# Altium project QUTMS-AMU-2021.PrjPcb (part 2 of 3)

## Sheet AMU-S12-V00-TSALControl.SchDoc: TSAL Control
size A3; DrawnBy: Tom Benedetti; SheetNumber: 11; SheetTotal: 25; Version: 00; Project: TSAL; PageSetup: Record=PageOptions|CenterHorizontal=True|CenterVertical=True|PrintScale=0.97|XCorrection=1.00|YCorrection=1.00|PrintKind=0|BorderSize=5000000|LeftOffset=0|BottomOffset=0|Orientation=2|PaperLength=1000|PaperWidth=1000|Scale=100|PaperSource=7|PrintQuality=-4|MediaType=1|DitherType=10|PaperKind=A4|PrintScaleMode=1
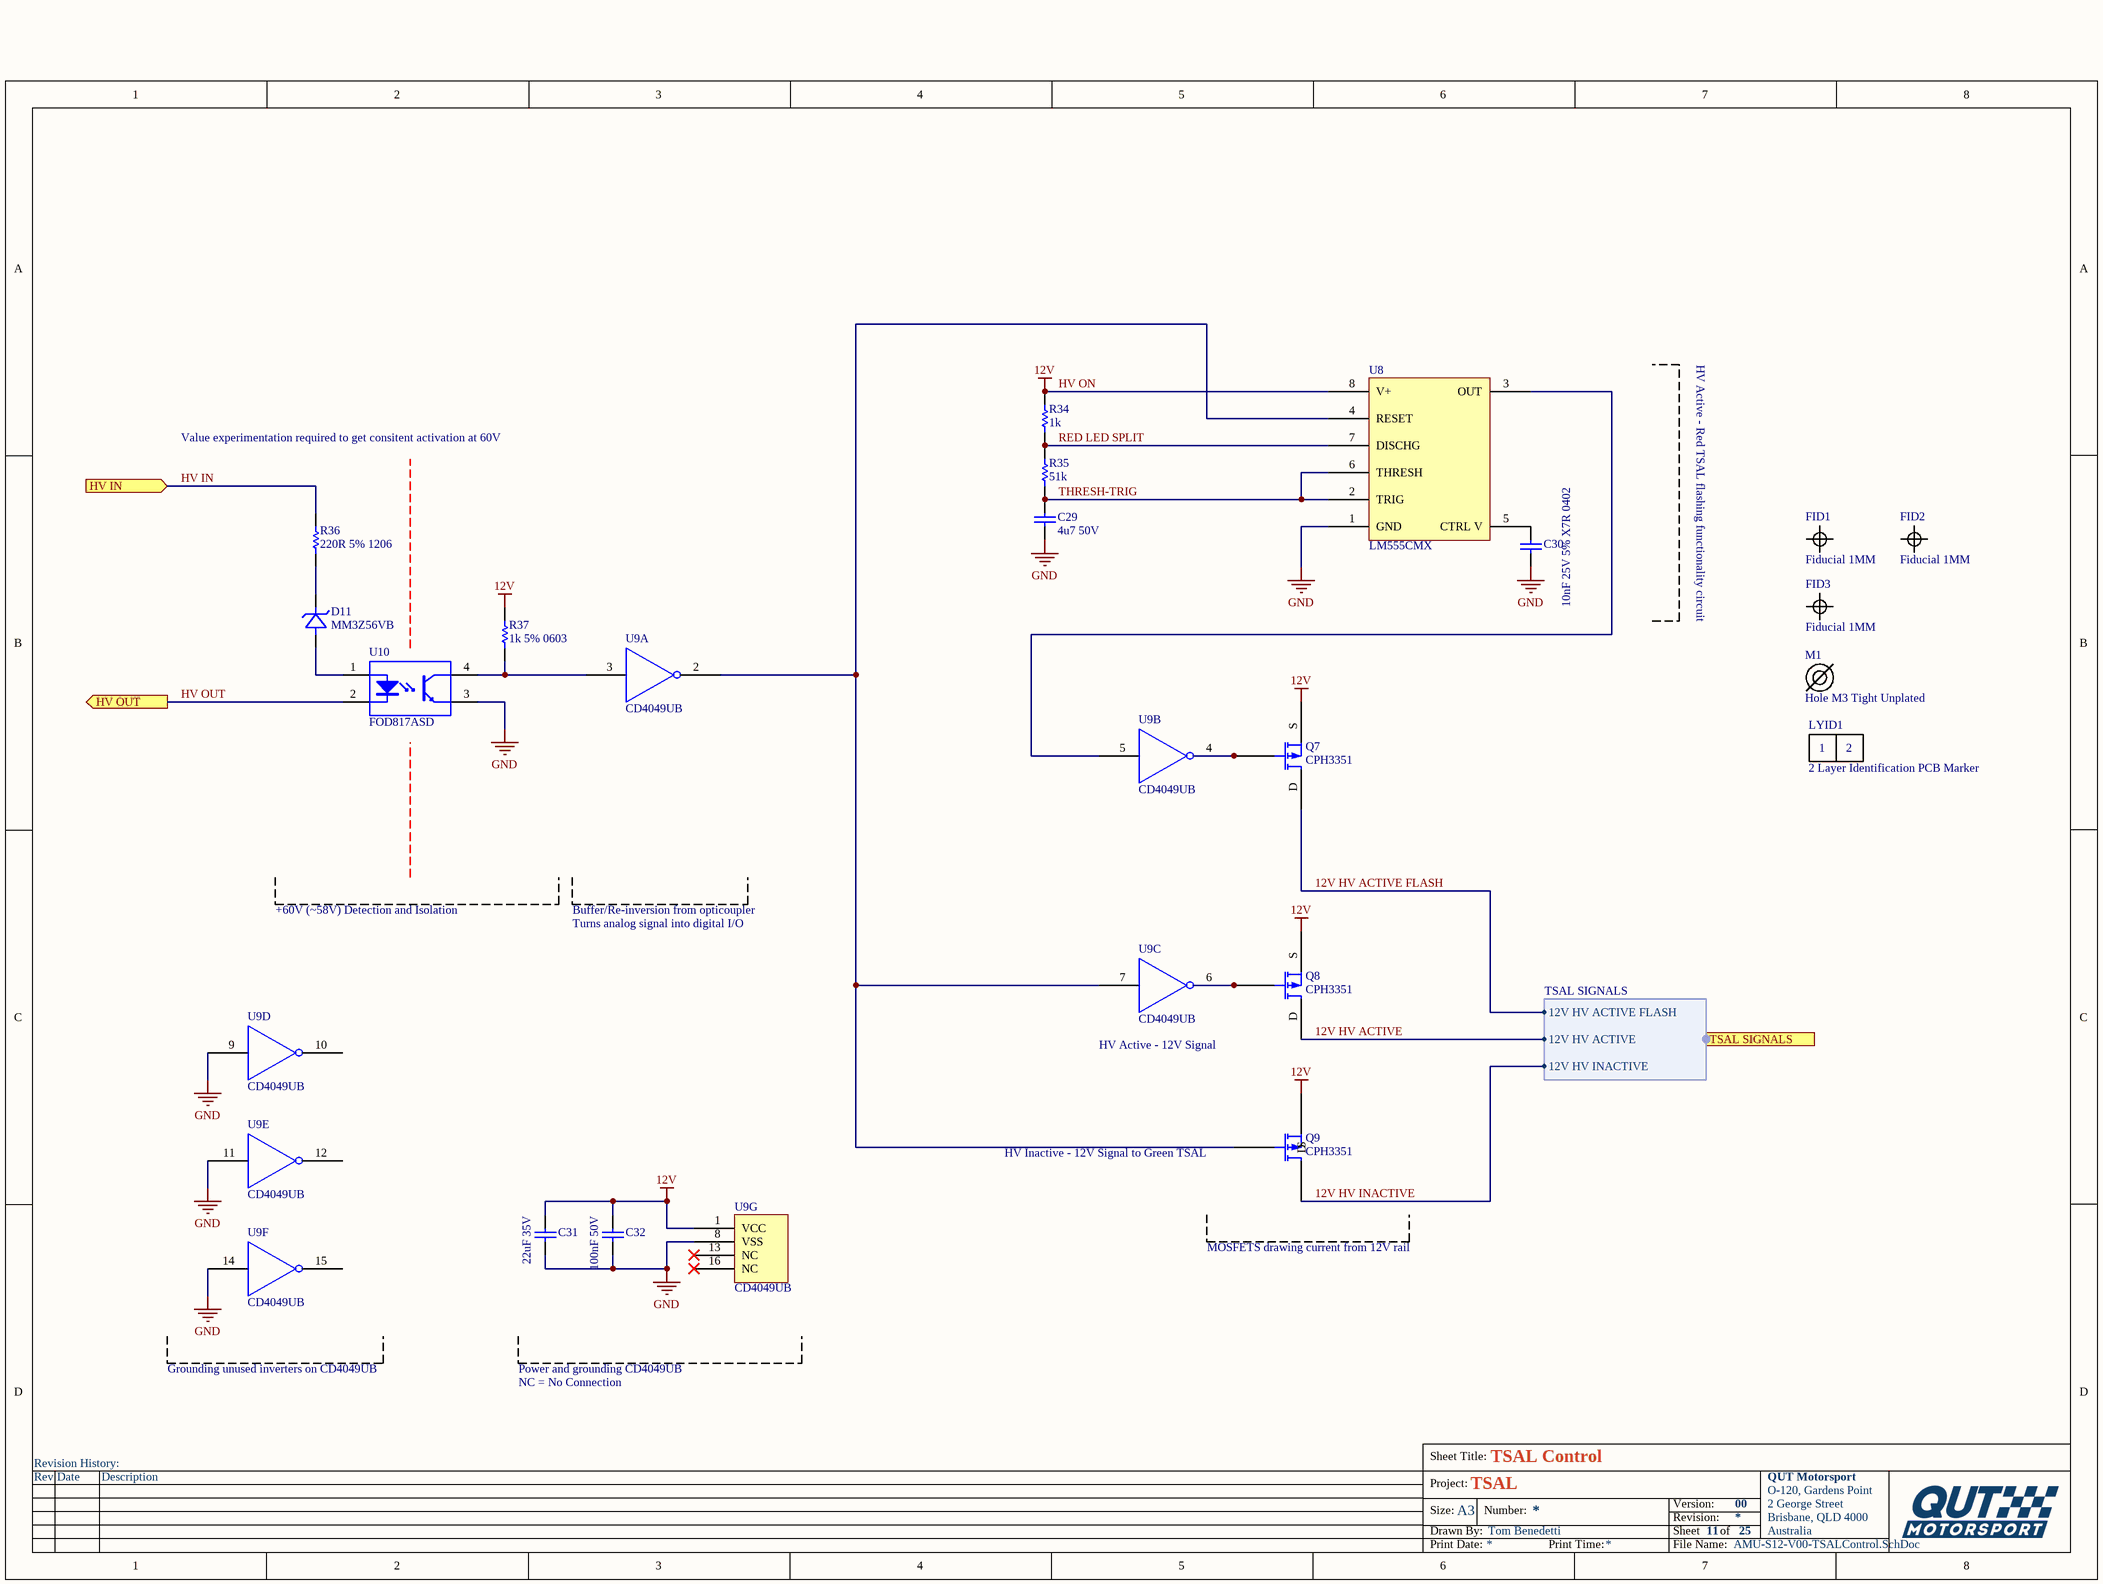
[diagram p10: AMU-S12-V00-TSALControl.SchDoc]

### Parts
(Parts that share a designator on the sheet are numbered #1, #2 ... from top to bottom, then left to right.)
C29  4u7 50V  [Cap_Ceramic_0603]
C30  10nF 25V 5% X7R 0402  [Cap_Ceramic_1206]
C31  22uF 35V  [Cap_Ceramic_1206]
C32  100nF 50V  [Cap_Ceramic_0603]
D11#1  MM3Z56VB  [SOD-323F]
FID1  Fiducial 1MM  [FIDUCIAL 1MM]
FID2  Fiducial 1MM  [FIDUCIAL 1MM]
FID3  Fiducial 1MM  [FIDUCIAL 1MM]
LYID1  2 Layer Identification PCB Marker  [LAYER IDENT 2]
M1  Hole M3 Tight Unplated  [M3.2 UNPLATED]
Q7  CPH3351  [SOT-23-3]
Q8#1  CPH3351  [SOT-23-3]
Q9#1  CPH3351  [SOT-23-3]
R34  1k  [Res_ThinFilm_0603]
R35#1  51k  [Res_ThinFilm_0603]
R36#1  220R 5% 1206  [Res_ThinFilm_1206]
R37  1k 5% 0603  [Res_ThinFilm_0603]
U8  LM555CMX  [MCP2561 SOIC]
U9  CD4049UB  [CD4049UB]  (parts A,B,C,D,E,F,G of 7)
U10  FOD817ASD  [FOD817ASD]

### Ports
HV IN (in), HV OUT (out), TSAL SIGNALS (harness TSAL SIGNALS)

### Harnesses
TSAL SIGNALS: 12V HV ACTIVE, 12V HV ACTIVE FLASH, 12V HV INACTIVE

### Nets
GND: C29.1 C30.1 C31.1 C32.1 U8.1(GND) U9.8(VSS) U9.9(D) U9.11(E) U9.14(F) U10.3(EMITTER)
HV ON: C31.2 C32.2 Q7.S Q8#1.S Q9#1.S R34.2 R37.2 U8.8(V+) U9.1(VCC)  [also labelled 12V]
12V HV ACTIVE: Q8#1.D ; port TSAL SIGNALS.12V HV ACTIVE
12V HV ACTIVE FLASH: Q7.D ; port TSAL SIGNALS.12V HV ACTIVE FLASH
12V HV INACTIVE: Q9#1.D ; port TSAL SIGNALS.12V HV INACTIVE
HV IN: R36#1.2 ; port HV IN
HV OUT: U10.2(CATHODE) ; port HV OUT
RED LED SPLIT: R34.1 R35#1.2 U8.7(DISCHG)
THRESH-TRIG: C29.2 R35#1.1 U8.2(TRIG) U8.6(THRESH)
NetC30_2: C30.2 U8.5(CTRL_V)
NetD11#1_1: D11#1.1(Anode) U10.1(ANODE)
NetD11#1_2: D11#1.2(Cathode) R36#1.1
NetQ7_G: Q7.G U9.4(H)
NetQ8#1_G: Q8#1.G U9.6(I)
NetQ9#1_G: Q9#1.G U8.4(RESET) U9.2(G) U9.7(C)
NetR37_1: R37.1 U9.3(A) U10.4(COLLECTOR)
NetU8_3: U8.3(OUT) U9.5(B)

Not connected (* = marked no-connect by the designer): U9 10(J) 12(K) 13(NC)* 15(L) 16(NC)*

### Notes on the sheet
- HV Active - Red TSAL flashing functionality circuit
- Value experimentation required to get consitent activation at 60V
- +60V (~58V) Detection and Isolation
- Buffer/Re-inversion from opticoupler
- Turns analog signal into digital I/O
- HV Active - 12V Signal
- (near Q9#1) HV Inactive - 12V Signal to Green TSAL
- MOSFETS drawing current from 12V rail
- Grounding unused inverters on CD4049UB
- Power and grounding CD4049UB
- NC = No Connection
- Revision History:
- Sheet Title:
- Rev
- Date
- Description
- Project:
- Size:
- Drawn By:
- A3
- Number:
- Revision:
- Sheet
- Version:
- of
- QUT Motorsport
- O-120, Gardens Point
- 2 George Street
- Brisbane, QLD 4000
- Australia
- Print Date:
- Print Time:
- File Name:
- (in symbol Layer Identification 2) 1; 2

### Library data of the parts
C29 = 4u7 50V 5% X7R 0603: as C15 on sheet AMU-S04-V00-Microcontroller
C30 = 10nF 25V 5% X7R 0402: 10000pF ±5% 25V Ceramic Capacitor X7R 0402 (1005 Metric) /; ComponentLink1Description: Digikey; ComponentLink1URL: https://www.digikey.com/product-detail/en/murata-electronics/GRM155R71E103JA01J/490-6340-1-ND/3845537; ComponentLink2Description: Datasheet; ComponentLink2URL: https://search.murata.co.jp/Ceramy/image/img/A01X/G101/ENG/GRM155R71E103JA01-01.pdf
C31 = 22uF 35V 20% X5R 1206: 22µF ±20% 35V Ceramic Capacitor X5R 1206 (3216 Metric); ComponentLink1Description: Digikey; ComponentLink1URL: https://www.digikey.com.au/product-detail/en/tdk-corporation/C3216X5R1V226M160AC/445-8045-1-ND/2792165; ComponentLink2Description: Datasheet; ComponentLink2URL: https://product.tdk.com/info/en/catalog/datasheets/mlcc_commercial_general_en.pdf
C32 = 100nF 50V 5% X7R 0603: as C1 on sheet AMU-S02-V00-PSU3V3
D11#1 = MM3Z56VB: Zener Diode 56V 200mW ±2% Surface Mount SOD-323F; Manufacturer: ON Semiconductor; MPN: MM3Z56VB; ComponentLink1Description: Digikey; ComponentLink1URL: https://www.digikey.com.au/product-detail/en/on-semiconductor/MM3Z56VB/MM3Z56VBCT-ND/1626897; ComponentLink2Description: Datasheet; ComponentLink2URL: https://www.onsemi.com/pub/Collateral/MM3Z9V1B-D.pdf
LYID1 = Layer Identification 2
M1 = Hole M3 Tight Unplated: M3.2 Hole, No Plating
Q7 Q8#1 Q9#1 = CPH3351: P-Channel 60V 1.8A (Ta) 1W (Ta) Surface Mount 3-CPH; ComponentLink1Description: Datasheet; ComponentLink1URL: https://www.onsemi.com/pub/Collateral/CPH3351-D.PDF; ComponentLink2Description: Digikey; ComponentLink2URL: https://www.digikey.com/products/en/discrete-semiconductor-products/transistors-fets-mosfets-single/278?k=&pkeyword=&sv=0&pv7=2&sf=0&FV=-1%7C488%2C-8%7C278&mpart=CPH3351-TL-W&quantity=&ColumnSort=0&page=1&stock=1&nstock=1&datasheet=1&photo=1&pageSize=25
R34 R37 = 1k 5% 0603: Resistor, SMD, 1k, 0.1W, 5%, 0603
R35#1 = 51k 5% 0603: 51 kOhms ±0.1% 0.063W, 1/16W Chip Resistor 0402 (1005 Metric) Automotive AEC-Q200 Thin Film; ComponentLink1Description: Digikey; ComponentLink1URL: https://www.digikey.com.au/product-detail/en/panasonic-electronic-components/ERA-2AEB513X/P51KDCCT-ND/1706224; ComponentLink2Description: Datasheet1; ComponentLink2URL: https://industrial.panasonic.com/cdbs/www-data/pdf/RDM0000/AOA0000C307.pdf; ComponentLink3Description: Datasheet2; ComponentLink3URL: https://media.digikey.com/pdf/Data%20Sheets/Panasonic%20Resistors%20Thermistors%20PDFs/ERA_Series_LE.pdf; ComponentLink4Description: Datasheet3; ComponentLink4URL: https://industrial.panasonic.com/cdbs/www-data/pdf/RDM0000/DMM0000COL9.pdf
R36#1 = 220R 5% 1206: 220 Ohms ±1% 0.25W, 1/4W Chip Resistor 1206 (3216 Metric) Moisture Resistant Thick Film; ComponentLink1Description: Digikey; ComponentLink1URL: https://www.digikey.com.au/product-detail/en/yageo/RC1206FR-07220RL/311-220FRCT-ND/731640; ComponentLink2Description: Datasheet; ComponentLink2URL: https://www.yageo.com/upload/media/product/productsearch/datasheet/rchip/PYu-RC_Group_51_RoHS_L_10.pdf
U8 = LM555CMX: 555 Type, Timer/Oscillator (Single) IC 100kHz 8-SOIC; ComponentLink1Description: Digikey; ComponentLink1URL: https://www.digikey.com.au/product-detail/en/texas-instruments/LM555CMX%2FNOPB/LM555CMX%2FNOPBCT-ND/1010545?utm_adgroup=Integrated%20Circuits&utm_source=google&utm_medium=cpc&utm_campaign=Dynamic%20Search_EN_Product&utm_term=&productid=&gclid=CjwKCAjwr7X4BRA4EiwAUXjbt-N3vibcCncJp7dB6lpBrLRT-QxYTJoHZmGPqFSswFIeP9Lhu7cYVBoCjmMQAvD_BwE; ComponentLink2Description: Datasheet; ComponentLink2URL: https://www.ti.com/general/docs/suppproductinfo.tsp?distId=10&gotoUrl=http%3A%2F%2Fwww.ti.com%2Flit%2Fgpn%2Flm555
U10 = FOD817ASD: Optoisolator 5kV Transistor 4SMD

## Sheet AMU-S27-V00-MX120G-Interface.SchDoc
size A3; SheetNumber: 23; SheetTotal: 25
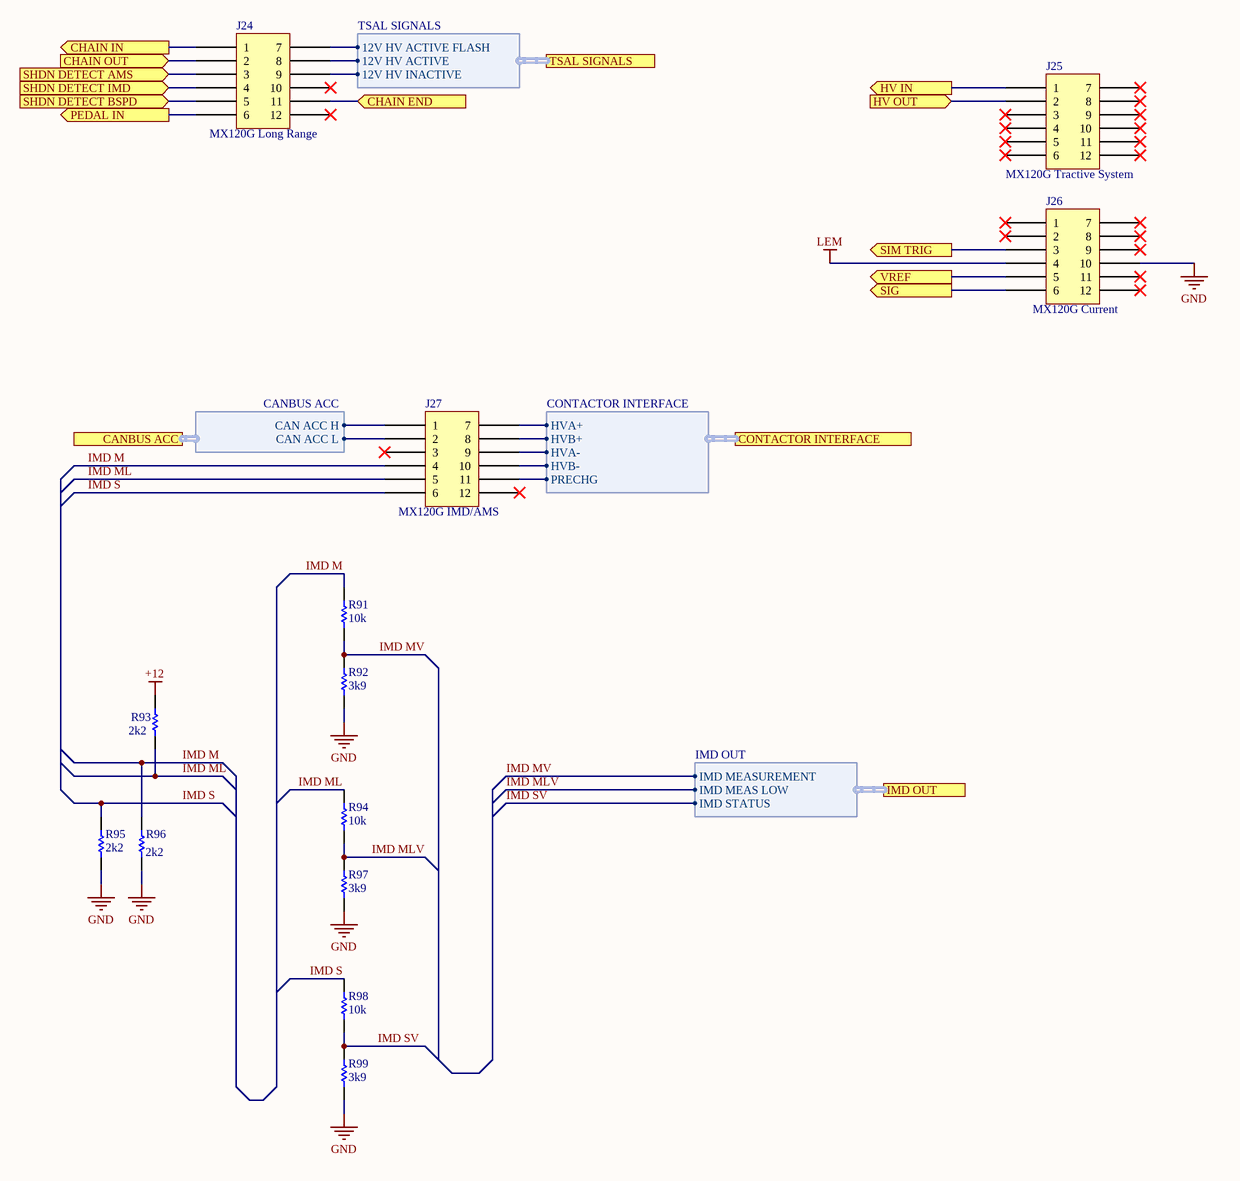
[diagram p11: AMU-S27-V00-MX120G-Interface.SchDoc]

### Parts
J24  MX120G Long Range  [MX120G]
J25  MX120G Tractive System  [MX120G]
J26  MX120G Current  [MX120G]
J27  MX120G IMD/AMS  [MX120G]
R91  10k  [Res_ThinFilm_0603]
R92  3k9  [Res_ThinFilm_0603]
R93  2k2  [Res_ThinFilm_0603]
R94  10k  [Res_ThinFilm_0603]
R95  2k2  [Res_ThinFilm_0603]
R96  2k2  [Res_ThinFilm_0603]
R97  3k9  [Res_ThinFilm_0603]
R98  10k  [Res_ThinFilm_0603]
R99  3k9  [Res_ThinFilm_0603]

### Ports
CANBUS ACC (harness CANBUS ACC), CHAIN END (in), CHAIN IN (out), CHAIN OUT (in), CONTACTOR INTERFACE (harness CONTACTOR INTERFACE), HV IN (out), HV OUT (in), IMD OUT (harness IMD OUT), PEDAL IN (out), SHDN DETECT AMS (in), SHDN DETECT BSPD (in), SHDN DETECT IMD (in), SIG (out), SIM TRIG (out), TSAL SIGNALS (harness TSAL SIGNALS), VREF (out)

### Harnesses
CONTACTOR INTERFACE: HVA-, HVB+, HVA+, HVB-, PRECHG
IMD OUT: IMD MEASUREMENT, IMD MEAS LOW, IMD STATUS
TSAL SIGNALS: 12V HV INACTIVE, 12V HV ACTIVE, 12V HV ACTIVE FLASH
CANBUS ACC: CAN ACC H, CAN ACC L

### Nets
+12: R93.2
GND: J26.10 R92.1 R95.1 R96.1 R97.1 R99.1
LEM: J26.4
12V HV ACTIVE: J24.8 ; port TSAL SIGNALS.12V HV ACTIVE
12V HV ACTIVE FLASH: J24.7 ; port TSAL SIGNALS.12V HV ACTIVE FLASH
12V HV INACTIVE: J24.9 ; port TSAL SIGNALS.12V HV INACTIVE
CAN ACC H: J27.1 ; port CANBUS ACC.CAN ACC H
CAN ACC L: J27.2 ; port CANBUS ACC.CAN ACC L
CHAIN END: J24.11 ; port CHAIN END
CHAIN IN: J24.1 ; port CHAIN IN
CHAIN OUT: J24.2 ; port CHAIN OUT
CONTACTOR INTERFACE.HVA+: J27.7 ; port CONTACTOR INTERFACE.HVA+
CONTACTOR INTERFACE.HVA-: J27.9 ; port CONTACTOR INTERFACE.HVA-
CONTACTOR INTERFACE.HVB+: J27.8 ; port CONTACTOR INTERFACE.HVB+
CONTACTOR INTERFACE.HVB-: J27.10 ; port CONTACTOR INTERFACE.HVB-
CONTACTOR INTERFACE.PRECHG: J27.11 ; port CONTACTOR INTERFACE.PRECHG
HV IN: J25.1 ; port HV IN
HV OUT: J25.2 ; port HV OUT
IMD M: J27.4 R91.2 R96.2
IMD ML: J27.5 R93.1 R94.2
IMD MLV: R94.1 R97.2 ; port IMD OUT.IMD MEAS LOW
IMD MV: R91.1 R92.2 ; port IMD OUT.IMD MEASUREMENT
IMD S: J27.6 R95.2 R98.2
IMD SV: R98.1 R99.2 ; port IMD OUT.IMD STATUS  [project net IMD OUT.IMD STATUS]
LEM REF: J26.5 ; port VREF
LEM SIG: J26.6 ; port SIG
PEDAL IN: J24.6 ; port PEDAL IN
SHDN DETECT AMS: J24.3 ; port SHDN DETECT AMS
SHDN DETECT BSPD: J24.5 ; port SHDN DETECT BSPD
SHDN DETECT IMD: J24.4 ; port SHDN DETECT IMD
SIM TRIG: J26.3 ; port SIM TRIG

Not connected (* = marked no-connect by the designer): J24 10* 12*; J25 3* 4* 5* 6* 7* 8* 9* 10* 11* 12*; J26 1* 2* 7* 8* 9* 11* 12*; J27 3* 12*

### Library data of the parts
J24-J27 = MX120G: MX120G with standard connector layout
R91 R94 R98 = 10k 1% 0603: Resistor, SMD, 10k, 0.1W, 1%, 0603
R92 R97 R99 = 3k9 5% 0603: Resistor, SMD, 3k9, 0.1W, 5%, 0603
R93 R95 R96 = 2k2 5% 0603: Resistor, SMD, 2k2, 0.1W, 5%, 0603

## Sheet AMU-S13-V00-BSPDShutdownRelay.SchDoc: Shutdown Relay
size A3; DrawnBy: Jonn Dillon; DocumentNumber: 9; Revision: 01; SheetNumber: 13; SheetTotal: 31
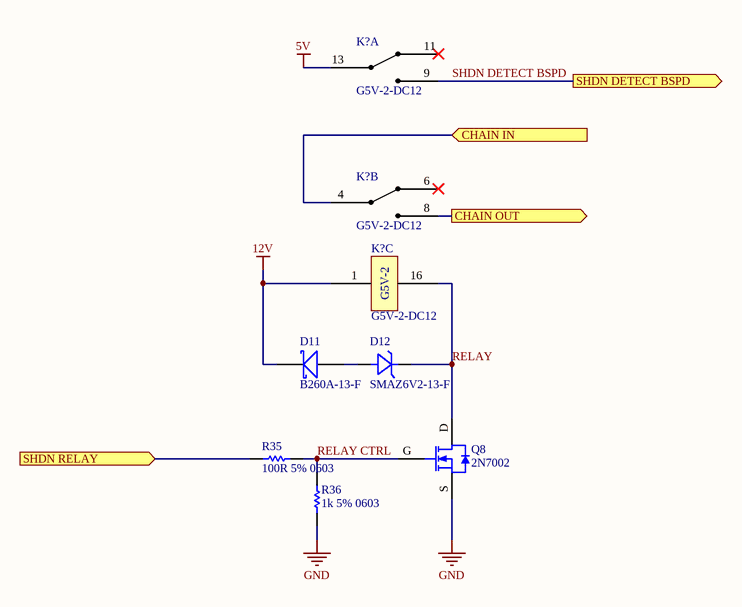
[diagram p12: AMU-S13-V00-BSPDShutdownRelay.SchDoc]

### Parts
(Parts that share a designator on the sheet are numbered #1, #2 ... from top to bottom, then left to right.)
D11#2  B260A-13-F  [SMA]
D12  SMAZ6V2-13-F  [SMA]
K?#1  G5V-2-DC12  [G5V-2]  (part A of 3)
K?#2  G5V-2-DC12  [G5V-2]  (part B of 3)
K?#3  G5V-2-DC12  [G5V-2]  (part C of 3)
Q8#2  2N7002  [SOT23-3]
R35#2  100R 5% 0603  [Res_ThinFilm_0603]
R36#2  1k 5% 0603  [Res_ThinFilm_0603]

### Ports
CHAIN IN (in), CHAIN OUT (out), SHDN DETECT BSPD (out), SHDN RELAY (in)

### Nets
5V: K?#1.13
12V: D11#2.K K?#3.1  [project net HV ON]
GND: Q8#2.S R36#2.1
BSPD6: R35#2.1 ; port SHDN RELAY
CHAIN BSPD-AMS: K?#2.8 ; port CHAIN OUT
CHAIN IN: K?#2.4 ; port CHAIN IN
RELAY: D12.K(Cathode) K?#3.16 Q8#2.D
RELAY CTRL: Q8#2.G R35#2.2 R36#2.2
SHDN DETECT BSPD: K?#1.9 ; port SHDN DETECT BSPD
NetD11#2_A: D11#2.A D12.A(Anode)

Not connected (* = marked no-connect by the designer): K?#1 11*; K?#2 6*

### Notes on the sheet
- Revision History:
- Sheet Title:
- Rev
- Date
- Description
- Project:
- Size:
- Drawn By:
- A3
- Number:
- Revision:
- Sheet
- Version:
- of
- QUT Motorsport
- O-120, Gardens Point
- 2 George Street
- Brisbane, QLD 4000
- Australia
- Print Date:
- Print Time:
- File Name:
- (in symbol G5V-2-DC12, part C) G5V-2

### Library data of the parts
D11#2 = B260A-13-F: Diode, Schottky Barrier Rectifier, 60 V, 2 A, B260A-13-F
D12 = SMAZ6V2-13-F: Zener Diode 6.2V 1W ±5% Surface Mount SMA; Manufacturer: Generic; MPN: 5V6 500mW SMA
K?#1-K?#3 = G5V-2-DC12: General Purpose Relay DPDT (2 Form C) Through Hole, 12V, 2A
R35#2 = 100R 5%, 0603: Resistor, SMD, 100R, 0.1W, 5%, 0603
R36#2 = 1k 5% 0603: Resistor, SMD, 1k, 0.1W, 5%, 0603

## Sheet AMU-S15-V00-BSPDSystem.SchDoc: BSPD System
size A3; DrawnBy: Jonn Dillon; DocumentNumber: 2; Revision: 01; SheetNumber: 13; SheetTotal: 23
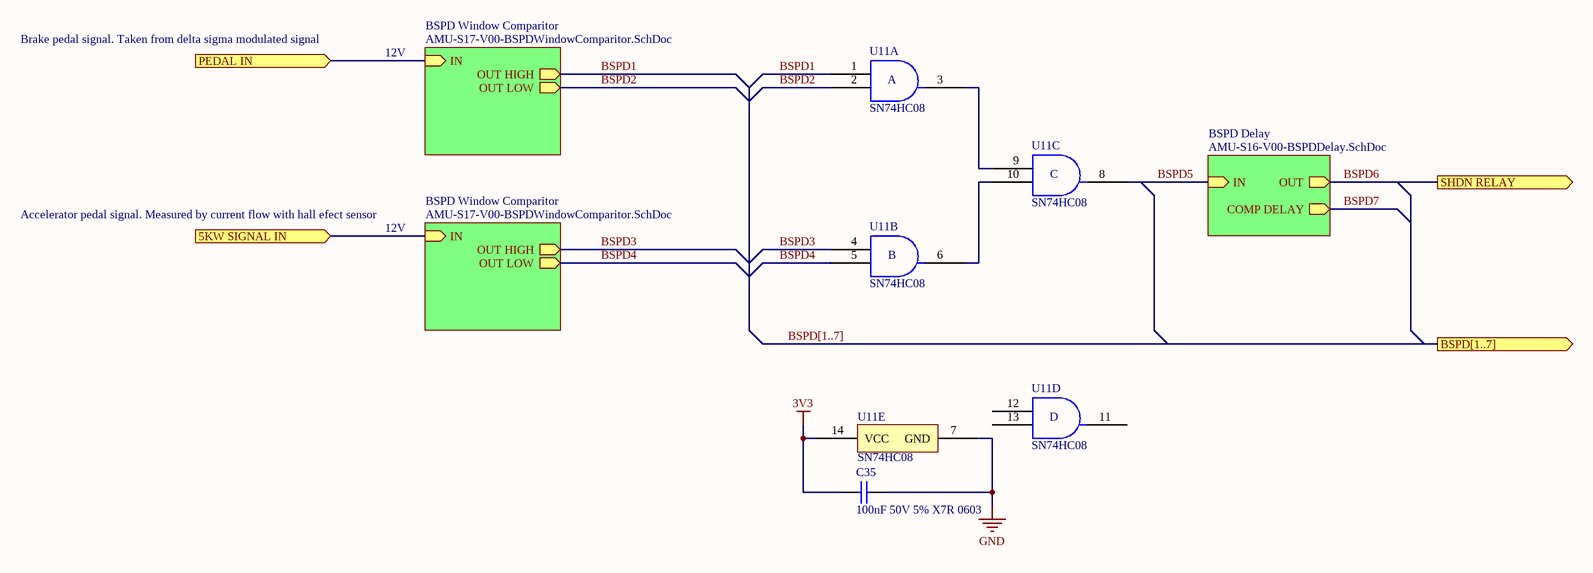
[diagram p13: AMU-S15-V00-BSPDSystem.SchDoc]

### Parts
(Parts that share a designator on the sheet are numbered #1, #2 ... from top to bottom, then left to right.)
C35#1  100nF 50V 5% X7R 0603  [Cap_Ceramic_0603]
U11  SN74HC08  [TSSOP-14]  (parts A,B,C,D,E of 5)

### Sub-sheets
BSPD Delay = AMU-S16-V00-BSPDDelay.SchDoc: OUT (out), IN (in), COMP DELAY (out)
BSPD Window Comparitor = AMU-S17-V00-BSPDWindowComparitor.SchDoc: OUT HIGH (out), IN (in), OUT LOW (out)
BSPD Window Comparitor = AMU-S17-V00-BSPDWindowComparitor.SchDoc: OUT HIGH (out), IN (in), OUT LOW (out)

### Ports
5KW SIGNAL IN (in), BSPD[1..7] (out), PEDAL IN (in), SHDN RELAY (out)

### Nets
3V3: C35#1.2 U11.14(VCC)
GND: C35#1.1 U11.7(GND)
5kW ALARM: port 5KW SIGNAL IN, sheet BSPD Window Comparitor/IN
BSPD1: U11.1(1A) ; sheet BSPD Window Comparitor/OUT HIGH
BSPD2: U11.2(1B) ; sheet BSPD Window Comparitor/OUT LOW
BSPD3: U11.4(2A) ; sheet BSPD Window Comparitor/OUT HIGH
BSPD4: U11.5(2B) ; sheet BSPD Window Comparitor/OUT LOW
BSPD5: U11.8(3Y) ; sheet BSPD Delay/IN
BSPD6: port SHDN RELAY, sheet BSPD Delay/OUT
PEDAL IN: port PEDAL IN, sheet BSPD Window Comparitor/IN
NetU11_3: U11.3(1Y) U11.9(3A)
NetU11_6: U11.6(2Y) U11.10(3B)

Not connected (* = marked no-connect by the designer): U11 11(4Y) 12(4A) 13(4B)

### Buses and harness runs
bus BSPD[1..7] = port BSPD[1..7]

### Notes on the sheet
- Brake pedal signal. Taken from delta sigma modulated signal
- 12V
- Accelerator pedal signal. Measured by current flow with hall efect sensor
- Revision History:
- Sheet Title:
- Rev
- Date
- Description
- Project:
- Size:
- Drawn By:
- A3
- Number:
- Revision:
- Sheet
- Version:
- of
- QUT Motorsport
- O-120, Gardens Point
- 2 George Street
- Brisbane, QLD 4000
- Australia
- Print Date:
- Print Time:
- File Name:
- (in symbol SN74HC08, part A) A
- (in symbol SN74HC08, part B) B
- (in symbol SN74HC08, part C) C
- (in symbol SN74HC08, part D) D

### Library data of the parts
C35#1 = 100nF 50V 5% X7R 0603: as C1 on sheet AMU-S02-V00-PSU3V3
U11 = SN74HC08: Quadruple 2-Input Positive-AND Gates

## Sheet AMU-S16-V00-BSPDDelay.SchDoc: RC Charging Delay
size A3; DrawnBy: Jonn Dillon; DocumentNumber: 4; Revision: 01; SheetNumber: 14; SheetTotal: 25
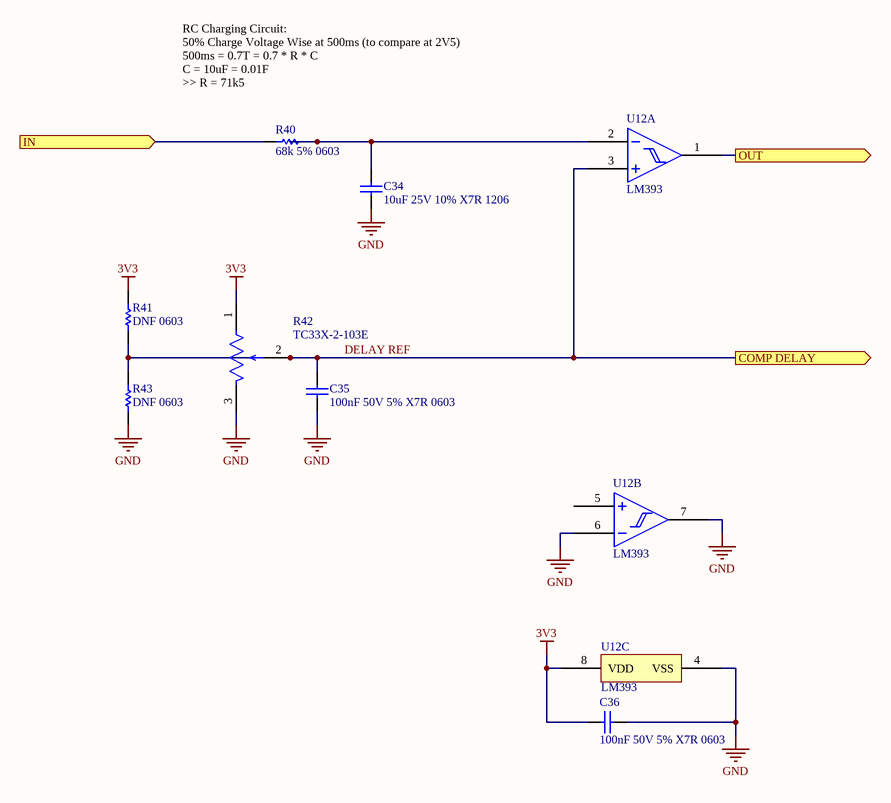
[diagram p14: AMU-S16-V00-BSPDDelay.SchDoc]

### Parts
(Parts that share a designator on the sheet are numbered #1, #2 ... from top to bottom, then left to right.)
C34  10uF 25V 10% X7R 1206  [Cap_Ceramic_1206]
C35#2  100nF 50V 5% X7R 0603  [Cap_Ceramic_0603]
C36  100nF 50V 5% X7R 0603  [Cap_Ceramic_0603]
R40  68k 5% 0603  [Res_ThinFilm_0603]
R41  DNF 0603  [Res_ThinFilm_0603]
R42  TC33X-2-103E  [TC33]
R43  DNF 0603  [Res_ThinFilm_0603]
U12  LM393  [TSSOP-8]  (parts A,B,C of 3)

### Ports
COMP DELAY (out), IN (in), OUT (out)

### Nets
3V3: C36.2 R41.2 R42.1 U12.8(VDD)
GND: C34.1 C35#2.1 C36.1 R42.3 R43.1 U12.4(VSS) U12.6(IN2-) U12.7(OUT1)
BSPD5: R40.1 ; port IN
BSPD6: U12.1(OUT1) ; port OUT
DELAY REF: C35#2.2 R41.1 R42.2 R43.2 U12.3(IN1+) ; port COMP DELAY  [project net BSPD7]
NetC34_2: C34.2 R40.2 U12.2(IN1-)

Not connected (* = marked no-connect by the designer): U12 5(IN2+)

### Notes on the sheet
- RC Charging Circuit:
  50% Charge Voltage Wise at 500ms (to compare at 2V5)
  500ms = 0.7T = 0.7 * R * C
  C = 10uF = 0.01F
  >> R = 71k5
- Revision History:
- Sheet Title:
- Rev
- Date
- Description
- Project:
- Size:
- Drawn By:
- A3
- Number:
- Revision:
- Sheet
- Version:
- of
- QUT Motorsport
- O-120, Gardens Point
- 2 George Street
- Brisbane, QLD 4000
- Australia
- Print Date:
- Print Time:
- File Name:

### Library data of the parts
C34 = 10uF 25V 10% X7R 1206: Capacitor, Ceramic, SMD, 10uF, 25V, 10%, X7R, 1206
C35#2 C36 = 100nF 50V 5% X7R 0603: as C1 on sheet AMU-S02-V00-PSU3V3
R40 = 68k 5% 0603: Resistor, SMD, 68k, 0.1W, 5%, 0603
R41 R43 = DNF 0603: Resistor, SMD, DNF, 0.1W, 0603
R42 = TC33X-2-103E: 10 kOhms 0.1W, 1/10W J Lead Surface Mount Trimmer Potentiometer Cermet 1 Turn Top Adjustment
U12 = LM393: General Purpose Comparitor 2 Circuit 8-SOIC

## Sheet AMU-S17-V00-BSPDWindowComparitor.SchDoc: Window Comparitor
size A3; DrawnBy: Jonn Dillon; DocumentNumber: 3; Revision: 01; SheetNumber: 15; SheetTotal: 25
Used 2 times, as channels BSPD System/BSPD Window Comparitor, BSPD System/BSPD Window Comparitor. Parts and nets are listed once, with the designators drawn on the sheet.
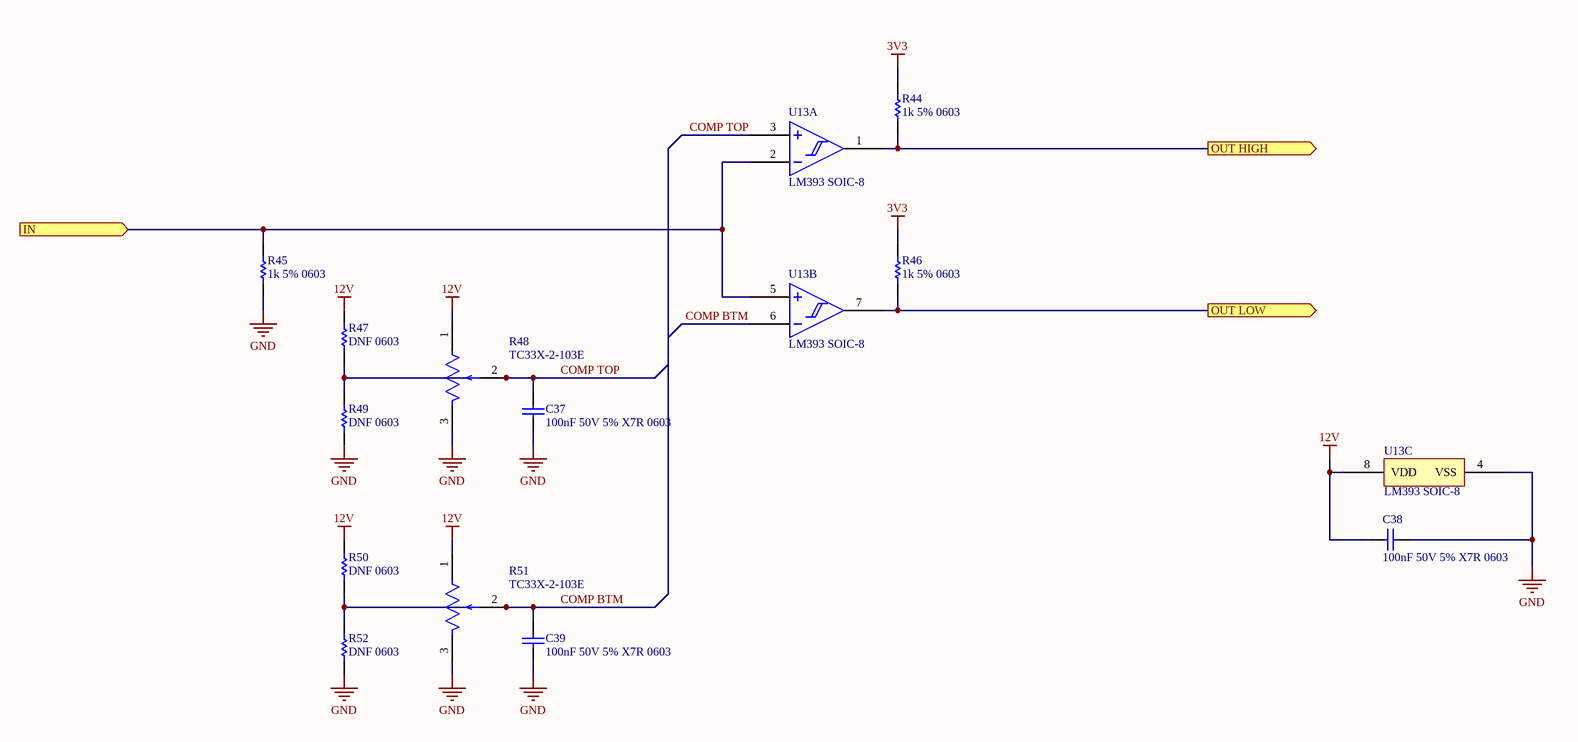
[diagram p15: AMU-S17-V00-BSPDWindowComparitor.SchDoc]

### Parts
C37  100nF 50V 5% X7R 0603  [Cap_Ceramic_0603]
C38  100nF 50V 5% X7R 0603  [Cap_Ceramic_0603]
C39  100nF 50V 5% X7R 0603  [Cap_Ceramic_0603]
R44  1k 5% 0603  [Res_ThinFilm_0603]
R45  1k 5% 0603  [Res_ThinFilm_0603]
R46  1k 5% 0603  [Res_ThinFilm_0603]
R47  DNF 0603  [Res_ThinFilm_0603]
R48  TC33X-2-103E  [TC33]
R49  DNF 0603  [Res_ThinFilm_0603]
R50  DNF 0603  [Res_ThinFilm_0603]
R51  TC33X-2-103E  [TC33]
R52  DNF 0603  [Res_ThinFilm_0603]
U13  LM393 SOIC-8  [SOIC-8]  (parts A,B,C of 3)

### Ports
IN (in), OUT HIGH (out), OUT LOW (out)

### Nets
3V3: R44.2 R46.2
12V: C38.1 R47.2 R48.1 R50.2 R51.1 U13.8(VDD)
GND: C37.1 C38.2 C39.1 R45.1 R48.3 R49.1 R51.3 R52.1 U13.4(VSS)
COMP BTM: C39.2 R50.1 R51.2 R52.2 U13.6(IN2-)
COMP TOP: C37.2 R47.1 R48.2 R49.2 U13.3(IN1+)
IN: R45.2 U13.2(IN1-) U13.5(IN2+) ; port IN
OUT HIGH: R44.1 U13.1(OUT1) ; port OUT HIGH
OUT LOW: R46.1 U13.7(OUT1) ; port OUT LOW

### Channels
BSPD System/BSPD Window Comparitor: designators end in _BSPD_System_BSPD_Window_Comparitor#1; ports IN=PEDAL IN OUT HIGH=BSPD1 OUT LOW=BSPD2
BSPD System/BSPD Window Comparitor: designators end in _BSPD_System_BSPD_Window_Comparitor#2; ports IN=5kW ALARM OUT HIGH=BSPD3 OUT LOW=BSPD4

### Notes on the sheet
- Revision History:
- Sheet Title:
- Rev
- Date
- Description
- Project:
- Size:
- Drawn By:
- A3
- Number:
- Revision:
- Sheet
- Version:
- of
- QUT Motorsport
- O-120, Gardens Point
- 2 George Street
- Brisbane, QLD 4000
- Australia
- Print Date:
- Print Time:
- File Name:

### Library data of the parts
C37-C39 = 100nF 50V 5% X7R 0603: as C1 on sheet AMU-S02-V00-PSU3V3
R44-R46 = 1k 5% 0603: Resistor, SMD, 1k, 0.1W, 5%, 0603
R47 R49 R50 R52 = DNF 0603: Resistor, SMD, DNF, 0.1W, 0603
R48 R51 = TC33X-2-103E: as R42 on sheet AMU-S16-V00-BSPDDelay
U13 = LM393: as U12 on sheet AMU-S16-V00-BSPDDelay

## Sheet AMU-S18-V00-CURRENTCurrentInterface.SchDoc: Current Sensor Circuity
size A3; DrawnBy: Jonn Dillon; DocumentNumber: 4; SheetNumber: 16; SheetTotal: 23; Project: Shutdown Current Board 2020
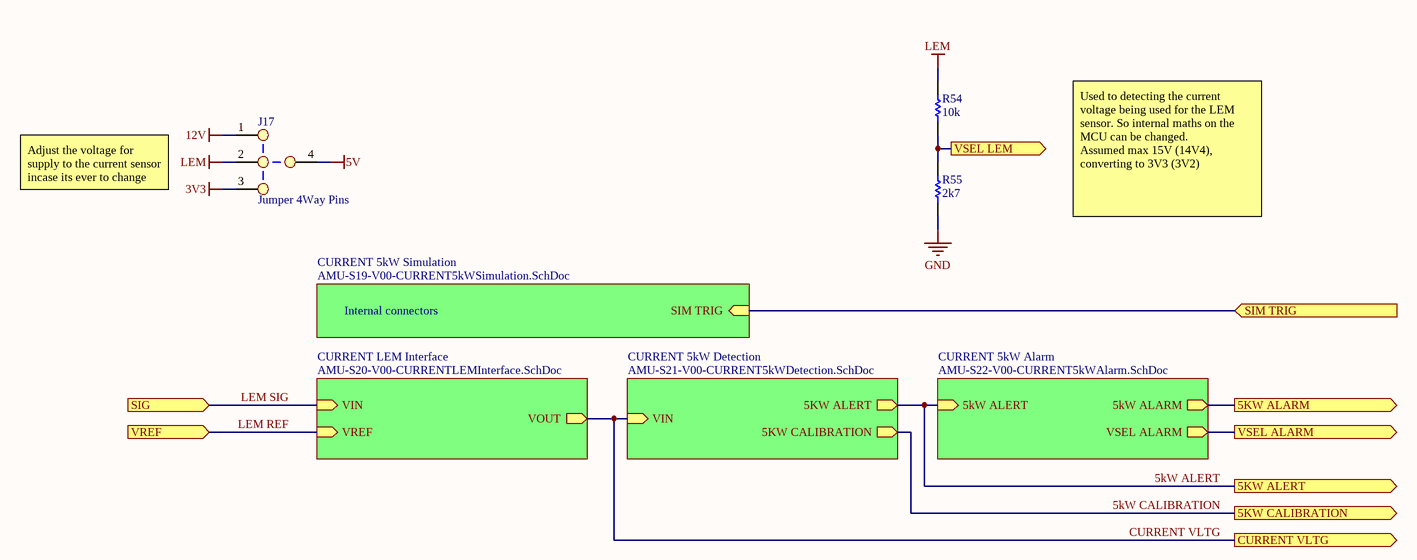
[diagram p16: AMU-S18-V00-CURRENTCurrentInterface.SchDoc]

### Parts
(Parts that share a designator on the sheet are numbered #1, #2 ... from top to bottom, then left to right.)
J17#1  Jumper 4Way Pins  [Jumper_4Way_Pin]
R54  10k  [Res_ThinFilm_0603]
R55  2k7  [Res_ThinFilm_0603]

### Sub-sheets
CURRENT 5kW Alarm = AMU-S22-V00-CURRENT5kWAlarm.SchDoc: 5kW ALARM (out), 5kW ALERT (in), VSEL ALARM (out)
CURRENT 5kW Detection = AMU-S21-V00-CURRENT5kWDetection.SchDoc: VIN (in), 5KW ALERT (out), 5KW CALIBRATION (out)
CURRENT 5kW Simulation = AMU-S19-V00-CURRENT5kWSimulation.SchDoc: SIM TRIG (in)
CURRENT LEM Interface = AMU-S20-V00-CURRENTLEMInterface.SchDoc: VOUT (out), VREF (in), VIN (in)

### Ports
5KW ALARM (out), 5KW ALERT (out), 5KW CALIBRATION (out), CURRENT VLTG (out), SIG (in), SIM TRIG (in), VREF (in), VSEL ALARM (out), VSEL LEM (out)

### Nets
3V3: J17#1.3
5V: J17#1.4
12V: J17#1.1  [project net HV ON]
GND: R55.1
LEM: J17#1.2 R54.2
5kW ALARM: port 5KW ALARM, sheet CURRENT 5kW Alarm/5kW ALARM
5kW ALERT: port 5KW ALERT, sheet CURRENT 5kW Detection/5KW ALERT, sheet CURRENT 5kW Alarm/5kW ALERT
5kW CALIBRATION: port 5KW CALIBRATION, sheet CURRENT 5kW Detection/5KW CALIBRATION
CURRENT VLTG: port CURRENT VLTG, sheet CURRENT LEM Interface/VOUT, sheet CURRENT 5kW Detection/VIN
LEM REF: port VREF, sheet CURRENT LEM Interface/VREF
LEM SIG: port SIG, sheet CURRENT LEM Interface/VIN
SIM TRIG: port SIM TRIG, sheet CURRENT 5kW Simulation/SIM TRIG
NetR54_1: R54.1 R55.2 ; port VSEL LEM
NetR67_1: port VSEL ALARM, sheet CURRENT 5kW Alarm/VSEL ALARM

### Notes on the sheet
- Adjust the voltage for supply to the current sensor incase its ever to change
- Used to detecting the current voltage being used for the LEM sensor. So internal maths on the MCU can be changed.
  Assumed max 15V (14V4), converting to 3V3 (3V2)
- Internal connectors
- Revision History:
- Sheet Title:
- Rev
- Date
- Description
- Project:
- Size:
- Drawn By:
- A3
- Number:
- Revision:
- Sheet
- Version:
- of
- QUT Motorsport
- O-120, Gardens Point
- 2 George Street
- Brisbane, QLD 4000
- Australia
- Print Date:
- Print Time:
- File Name:

### Library data of the parts
R54 = 10k 5% 0603: Resistor, SMD, 10k, 0.1W, 5%, 0603
R55 = 2k7 5% 0603: Resistor, SMD, 2k7, 0.1W, 5%, 0603

## Sheet AMU-S19-V00-CURRENT5kWSimulation.SchDoc: 5kW Simulation
size A3; DrawnBy: Jonn Dillon; DocumentNumber: 5; SheetNumber: 19; SheetTotal: 29; Project: Shutdown Current Board 2020
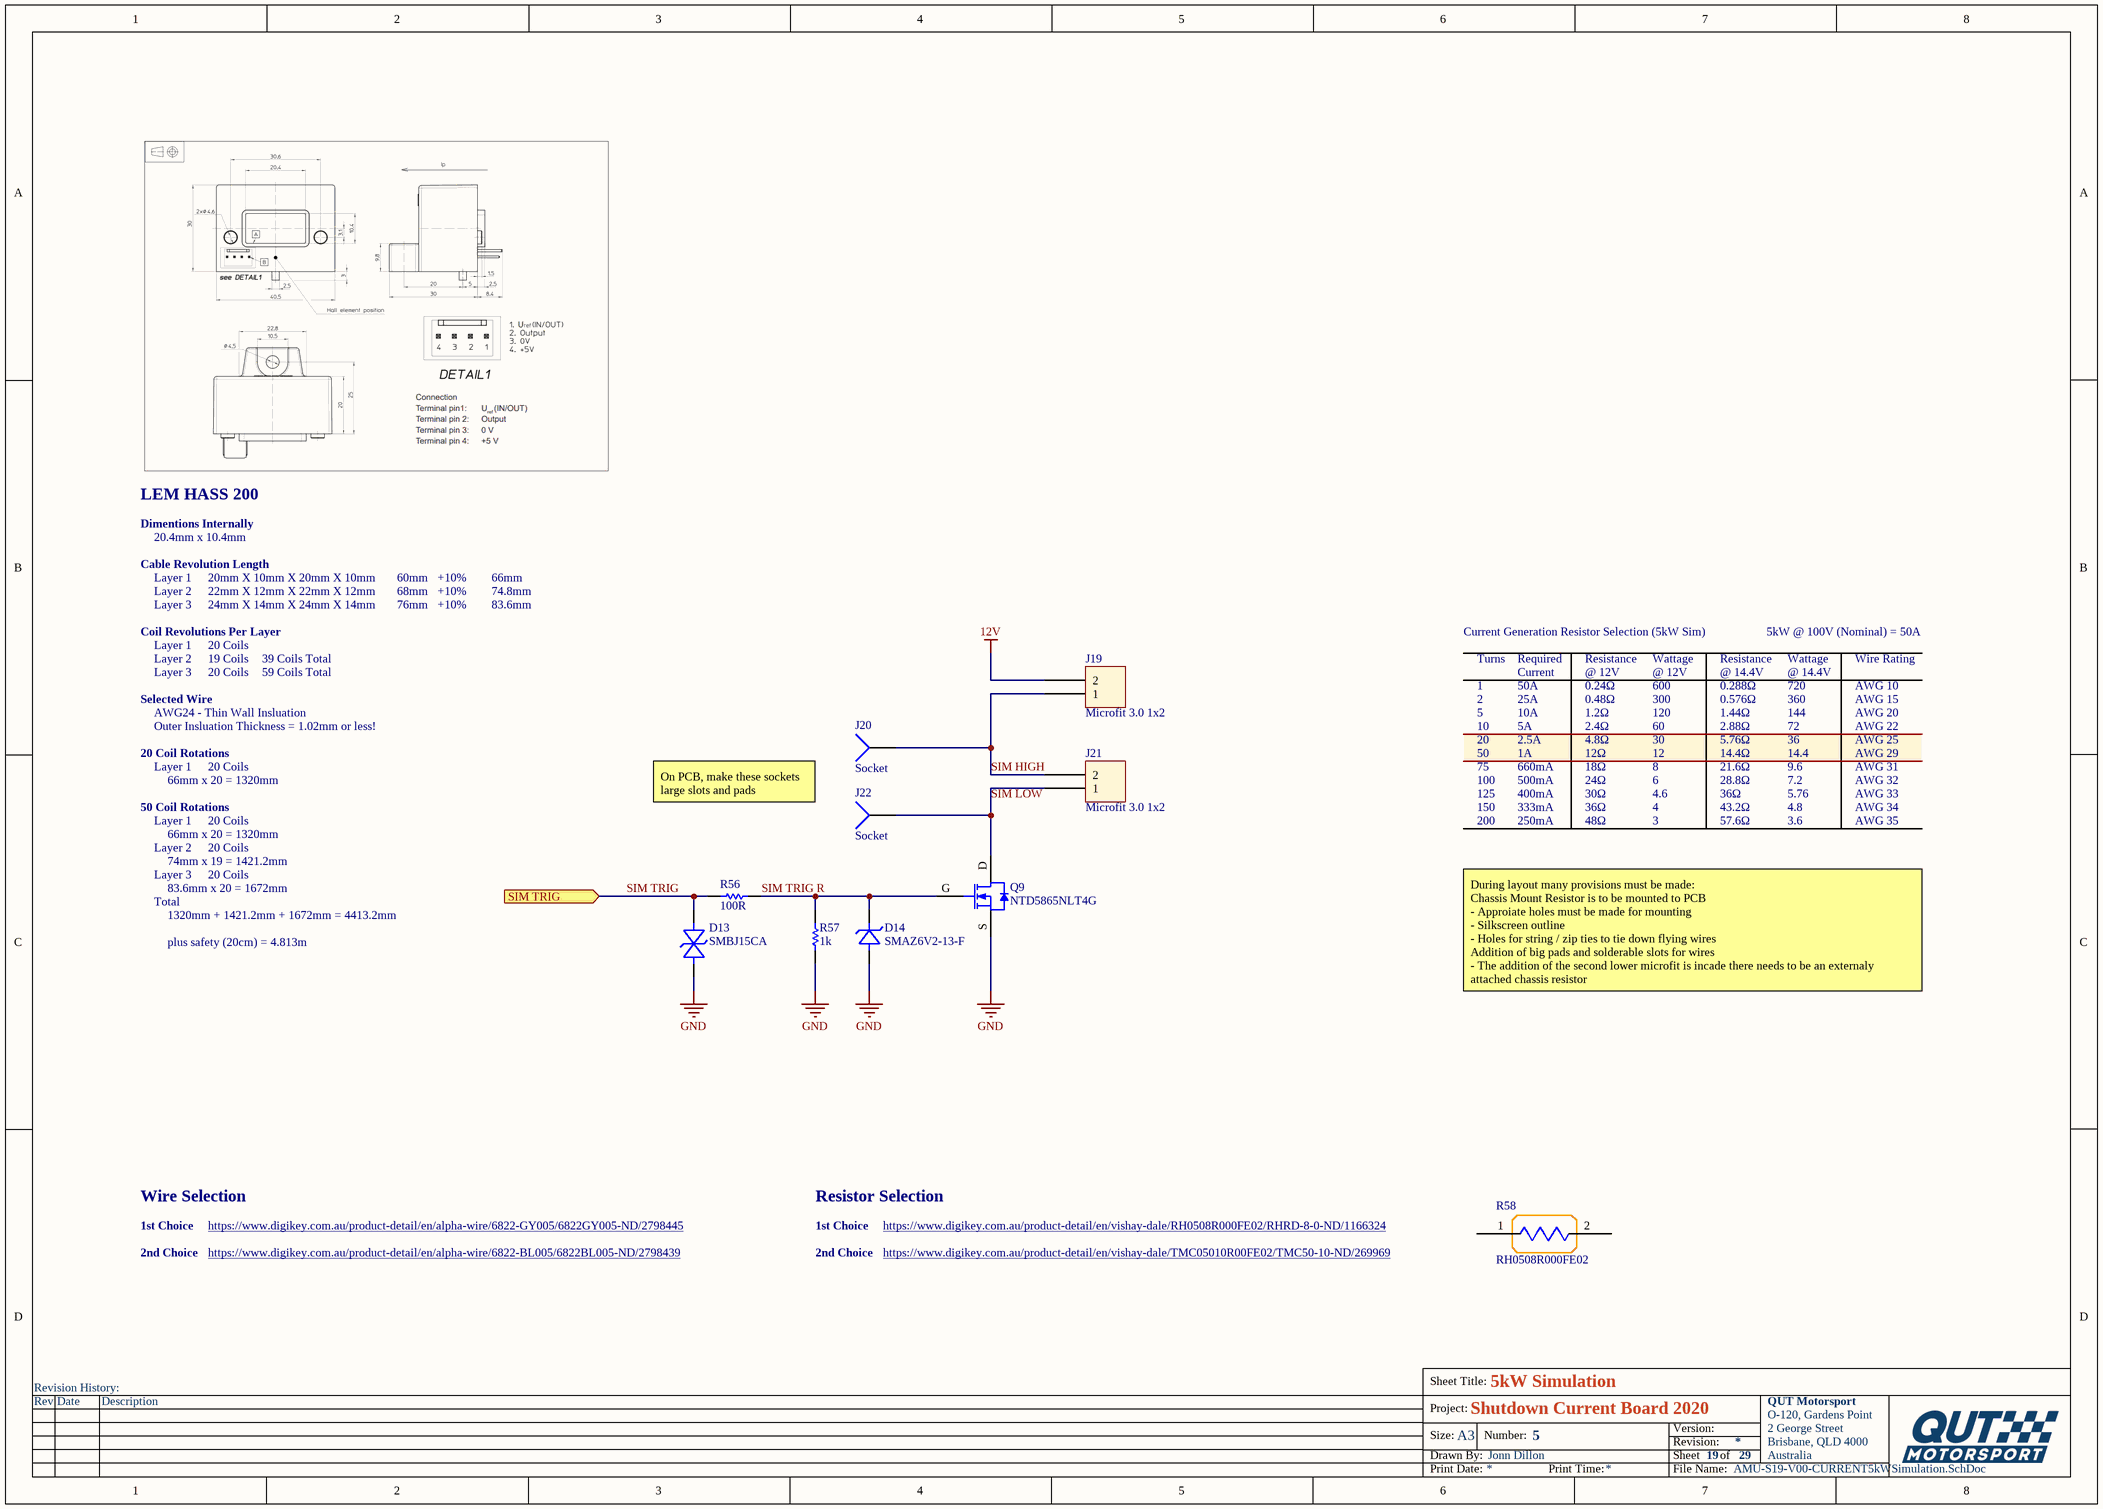
[diagram p17: AMU-S19-V00-CURRENT5kWSimulation.SchDoc]

### Parts
(Parts that share a designator on the sheet are numbered #1, #2 ... from top to bottom, then left to right.)
D13  SMBJ15CA  [SMB]
D14  SMAZ6V2-13-F  [SMA]
J19#1  Microfit 3.0 1x2  [Microfit_1X2_R_TH]
J20#1  Socket  [PIN1]
J21#1  Microfit 3.0 1x2  [Microfit_1X2_R_TH]
J22#1  Socket  [PIN1]
Q9#2  NTD5865NLT4G  [DPAK TO-252]
R56  100R  [Res_ThinFilm_0603]
R57  1k  [Res_ThinFilm_0603]
R58#1  RH0508R000FE02  [RH0508R000FE02]

### Ports
SIM TRIG (in)

### Nets
12V: J19#1.2  [project net HV ON]
GND: D13.A(Anode) D14.A(Anode) Q9#2.S R57.1
SIM HIGH: J19#1.1 J20#1.1 J21#1.2
SIM LOW: J21#1.1 J22#1.1 Q9#2.D
SIM TRIG: D13.K(Cathode) R56.1 ; port SIM TRIG
SIM TRIG R: D14.K(Cathode) Q9#2.G R56.2 R57.2

Not connected (* = marked no-connect by the designer): R58#1 1 2

### Notes on the sheet
- LEM HASS 200
- Dimentions Internally
- Cable Revolution Length
- 20.4mm x 10.4mm
- Layer 1
- 20mm X 10mm X 20mm X 10mm
- 60mm
- +10%
- 66mm
- Coil Revolutions Per Layer
- Layer 2
- Layer 3
- 22mm X 12mm X 22mm X 12mm
- 24mm X 14mm X 24mm X 14mm
- 20 Coils
- 68mm
- 76mm
- 74.8mm
- 83.6mm
- Current Generation Resistor Selection (5kW Sim)
- 5kW @ 100V (Nominal) = 50A
- Selected Wire
- AWG24 - Thin Wall Insluation
- 19 Coils
- 39 Coils Total
- 59 Coils Total
- Turns
- 1
- 2
- 5
- Required
- 50A
- 25A
- 10A
- Current
- 0.24Ω
- Resistance
- @ 12V
- 0.48Ω
- 1.2Ω
- 600
- Wattage
- 300
- 120
- @ 14.4V
- 0.288Ω
- 0.576Ω
- 1.44Ω
- 720
- 360
- 144
- Wire Rating
- AWG 10
- AWG 15
- AWG 20
- 20 Coil Rotations
- Outer Insluation Thickness = 1.02mm or less!
- 66mm x 20 = 1320mm
- 10
- 75
- 100
- 20
- 50
- 5A
- 660mA
- 500mA
- 2.5A
- 1A
- 2.4Ω
- 18Ω
- 24Ω
- 4.8Ω
- 12Ω
- 60
- 8
- 6
- 30
- 12
- 2.88Ω
- 21.6Ω
- 28.8Ω
- 5.76Ω
- 14.4Ω
- 72
- 9.6
- 7.2
- 36
- 14.4
- AWG 22
- AWG 31
- AWG 32
- AWG 25
- AWG 29
- 50 Coil Rotations
- On PCB, make these sockets large slots and pads
- 125
- 150
- 200
- 400mA
- 333mA
- 250mA
- 30Ω
- 36Ω
- 48Ω
- 4.6
- 4
- 3
- 43.2Ω
- 57.6Ω
- 5.76
- 4.8
- 3.6
- AWG 33
- AWG 34
- AWG 35
- Total
- 74mm x 19 = 1421.2mm
- 83.6mm x 20 = 1672mm
- 1320mm + 1421.2mm + 1672mm = 4413.2mm
- plus safety (20cm) = 4.813m
- During layout many provisions must be made:
  Chassis Mount Resistor is to be mounted to PCB
  - Approiate holes must be made for mounting
  - Silkscreen outline
  - Holes for string / zip ties to tie down flying wires
  Addition of big pads and solderable slots for wires
  - The addition of the second lower microfit is incade there needs to be an externaly attached chassis resistor
- 1st Choice
- 2nd Choice
- Wire Selection
- https://www.digikey.com.au/product-detail/en/alpha-wire/6822-BL005/6822BL005-ND/2798439
- https://www.digikey.com.au/product-detail/en/alpha-wire/6822-GY005/6822GY005-ND/2798445
- Resistor Selection
- https://www.digikey.com.au/product-detail/en/vishay-dale/TMC05010R00FE02/TMC50-10-ND/269969
- https://www.digikey.com.au/product-detail/en/vishay-dale/RH0508R000FE02/RHRD-8-0-ND/1166324
- Revision History:
- Sheet Title:
- Rev
- Date
- Description
- Project:
- Size:
- Drawn By:
- A3
- Number:
- Revision:
- Sheet
- Version:
- of
- QUT Motorsport
- O-120, Gardens Point
- 2 George Street
- Brisbane, QLD 4000
- Australia
- Print Date:
- Print Time:
- File Name:

### Library data of the parts
D13 = SMBJ15CA: Diode, SMD, TVS Diode, 15V 24.4V, DO214AA/SMB; ComponentLink1Description: Digikey; ComponentLink1URL: https://www.digikey.com.au/product-detail/en/littelfuse-inc/SMBJ15CA/SMBJ15CALFCT-ND/285983; ComponentLink2Description: Datasheet; ComponentLink2URL: https://www.littelfuse.com/~/media/electronics/datasheets/tvs_diodes/littelfuse_tvs_diode_smbj_datasheet.pdf.pdf
D14 = SMAZ6V2-13-F: Zener Diode 6.2V 1W ±5% Surface Mount SMA; Manufacturer: Generic; MPN: 5V6 500mW SMA
J19#1 J21#1 = Microfit_1x2
Q9#2 = NTD5865NLT4G: NTD5865NLT4G, 60V 46A
R56 = 100R 5%, 0603: Resistor, SMD, 100R, 0.1W, 5%, 0603
R57 = 1k 5% 0603: Resistor, SMD, 1k, 0.1W, 5%, 0603
R58#1 = RH0508R000FE02: 8 Ohms ±1% 50W Wirewound Chassis Mount Resistor; ComponentLink1Description: Digikey; ComponentLink1URL: https://www.digikey.com.au/product-detail/en/vishay-dale/RH0508R000FE02/RHRD-8-0-ND/1166324; ComponentLink2Description: Datasheet; ComponentLink2URL: https://www.vishay.com/docs/30201/rhnh.pdf
J20#1 J22#1 = Socket: LatestRevisionDate: 17-Jul-2002; LatestRevisionNote: Re-released for DXP Platform.; Publisher: Altium Limited

## Sheet AMU-S20-V00-CURRENTLEMInterface.SchDoc: Current Sensor Interface
size A3; DrawnBy: Jonn Dillon; DocumentNumber: 6; SheetNumber: 18; SheetTotal: 25; Project: Shutdown Current Board 2020
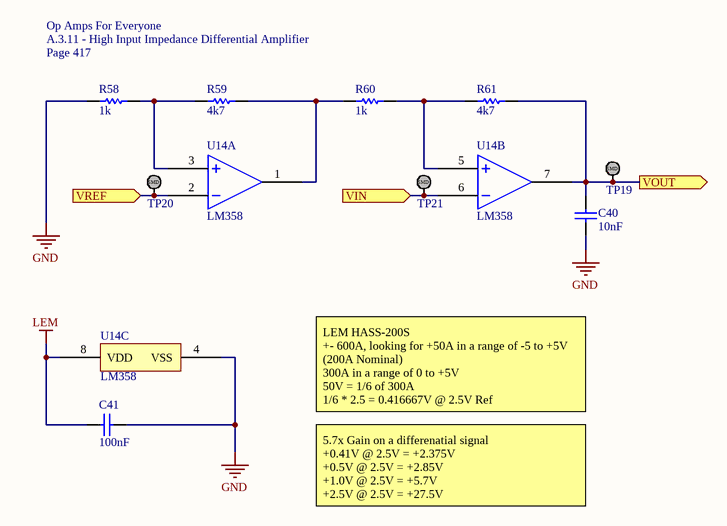
[diagram p18: AMU-S20-V00-CURRENTLEMInterface.SchDoc]

### Parts
(Parts that share a designator on the sheet are numbered #1, #2 ... from top to bottom, then left to right.)
C40  10nF  [Cap_Ceramic_0603]
C41  100nF  [Cap_Ceramic_0603]
R58#2  1k  [Res_ThinFilm_0603]
R59  4k7  [Res_ThinFilm_0603]
R60  1k  [Res_ThinFilm_0603]
R61  4k7  [Res_ThinFilm_0603]
TP19  TestPoint_SMD  [TestPointSMD]  (value not drawn)
TP20  TestPoint_SMD  [TestPointSMD]  (value not drawn)
TP21  TestPoint_SMD  [TestPointSMD]  (value not drawn)
U14  LM358  [TSSOP-8]  (parts A,B,C of 3)

### Ports
VIN (in), VOUT (out), VREF (in)

### Nets
GND: C40.1 C41.2 R58#2.1 U14.4(VSS)
LEM: C41.1 U14.8(VDD)
CURRENT VLTG: C40.2 R61.2 TP19.1 U14.7(OUT1) ; port VOUT
LEM REF: TP20.1 U14.2(IN1-) ; port VREF
LEM SIG: TP21.1 U14.6(IN2-) ; port VIN
NetR58#2_2: R58#2.2 R59.1 U14.3(IN1+)
NetR59_2: R59.2 R60.1 U14.1(OUT1)
NetR60_2: R60.2 R61.1 U14.5(IN2+)

### Notes on the sheet
- Op Amps For Everyone
- A.3.11 - High Input Impedance Differential Amplifier
- (near R58#2) Page 417
- LEM HASS-200S
  +- 600A, looking for +50A in a range of -5 to +5V
  (200A Nominal)
  300A in a range of 0 to +5V
  50V = 1/6 of 300A
  1/6 * 2.5 = 0.416667V @ 2.5V Ref
- 5.7x Gain on a differenatial signal
  +0.41V @ 2.5V = +2.375V
  +0.5V @ 2.5V = +2.85V
  +1.0V @ 2.5V = +5.7V
  +2.5V @ 2.5V = +27.5V
- Revision History:
- Sheet Title:
- Rev
- Date
- Description
- Project:
- Size:
- Drawn By:
- A3
- Number:
- Revision:
- Sheet
- Version:
- of
- QUT Motorsport
- O-120, Gardens Point
- 2 George Street
- Brisbane, QLD 4000
- Australia
- Print Date:
- Print Time:
- File Name:
- (in symbol TestPoint_SMD) SMD

### Library data of the parts
C40 = 10nF 50V 5% X7R 0603: Capacitor, Ceramic, SMD, 10nF, 50V, 5%, X7R, 0603
C41 = 100nF 50V 5% X7R 0603: Capacitor, Ceramic, SMD, 100nF, 50V, 5%, X7R, 0603
R58#2 R60 = 1k 5% 0603: Resistor, SMD, 1k, 0.1W, 5%, 0603
R59 R61 = 4k7 5% 0603: Resistor, SMD, 4k7, 0.1W, 5%, 0603
U14 = LM358: General Purpose Amplifier 2 Circuit 8-SOIC

## Sheet AMU-S21-V00-CURRENT5kWDetection.SchDoc: 5kW Detection / Comparison
size A3; DrawnBy: Jonn Dillon; DocumentNumber: 7; SheetNumber: 19; SheetTotal: 25; Project: Shutdown Current Board 2020
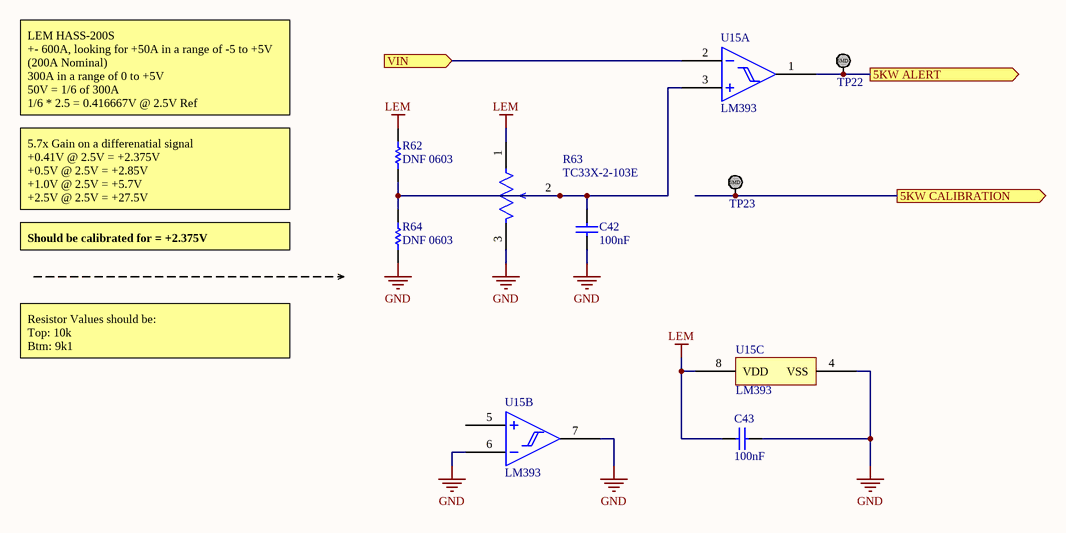
[diagram p19: AMU-S21-V00-CURRENT5kWDetection.SchDoc]

### Parts
C42  100nF  [Cap_Ceramic_0603]
C43  100nF  [Cap_Ceramic_0603]
R62  DNF 0603  [Res_ThinFilm_0603]
R63  TC33X-2-103E  [TC33]
R64  DNF 0603  [Res_ThinFilm_0603]
TP22  TestPoint_SMD  [TestPointSMD]  (value not drawn)
TP23  TestPoint_SMD  [TestPointSMD]  (value not drawn)
U15  LM393  [TSSOP-8]  (parts A,B,C of 3)

### Ports
5KW ALERT (out), 5KW CALIBRATION (out), VIN (in)

### Nets
GND: C42.1 C43.2 R63.3 R64.1 U15.4(VSS) U15.6(IN2-) U15.7(OUT1)
LEM: C43.1 R62.2 R63.1 U15.8(VDD)
5kW ALERT: TP22.1 U15.1(OUT1) ; port 5KW ALERT
5kW CALIBRATION: TP23.1 ; port 5KW CALIBRATION
CURRENT VLTG: U15.2(IN1-) ; port VIN
NetC42_2: C42.2 R62.1 R63.2 R64.2 U15.3(IN1+)

Not connected (* = marked no-connect by the designer): U15 5(IN2+)

### Notes on the sheet
- LEM HASS-200S
  +- 600A, looking for +50A in a range of -5 to +5V
  (200A Nominal)
  300A in a range of 0 to +5V
  50V = 1/6 of 300A
  1/6 * 2.5 = 0.416667V @ 2.5V Ref
- 5.7x Gain on a differenatial signal
  +0.41V @ 2.5V = +2.375V
  +0.5V @ 2.5V = +2.85V
  +1.0V @ 2.5V = +5.7V
  +2.5V @ 2.5V = +27.5V
- Should be calibrated for = +2.375V
- Resistor Values should be:
  Top: 10k
  Btm: 9k1
- Revision History:
- Sheet Title:
- Rev
- Date
- Description
- Project:
- Size:
- Drawn By:
- A3
- Number:
- Revision:
- Sheet
- Version:
- of
- QUT Motorsport
- O-120, Gardens Point
- 2 George Street
- Brisbane, QLD 4000
- Australia
- Print Date:
- Print Time:
- File Name:
- (in symbol TestPoint_SMD) SMD

### Library data of the parts
C42 C43 = 100nF 50V 5% X7R 0603: as C41 on sheet AMU-S20-V00-CURRENTLEMInterface
R62 R64 = DNF 0603: Resistor, SMD, DNF, 0.1W, 0603
R63 = TC33X-2-103E: 10 kOhms 0.1W, 1/10W J Lead Surface Mount Trimmer Potentiometer Cermet 1 Turn Top Adjustment
U15 = LM393: General Purpose Comparitor 2 Circuit 8-SOIC

## Sheet AMU-S22-V00-CURRENT5kWAlarm.SchDoc: 5kW Alarm
size A3; DrawnBy: Jonn Dillon; DocumentNumber: 10; SheetNumber: 20; SheetTotal: 25; Project: Shutdown Current Board 2020
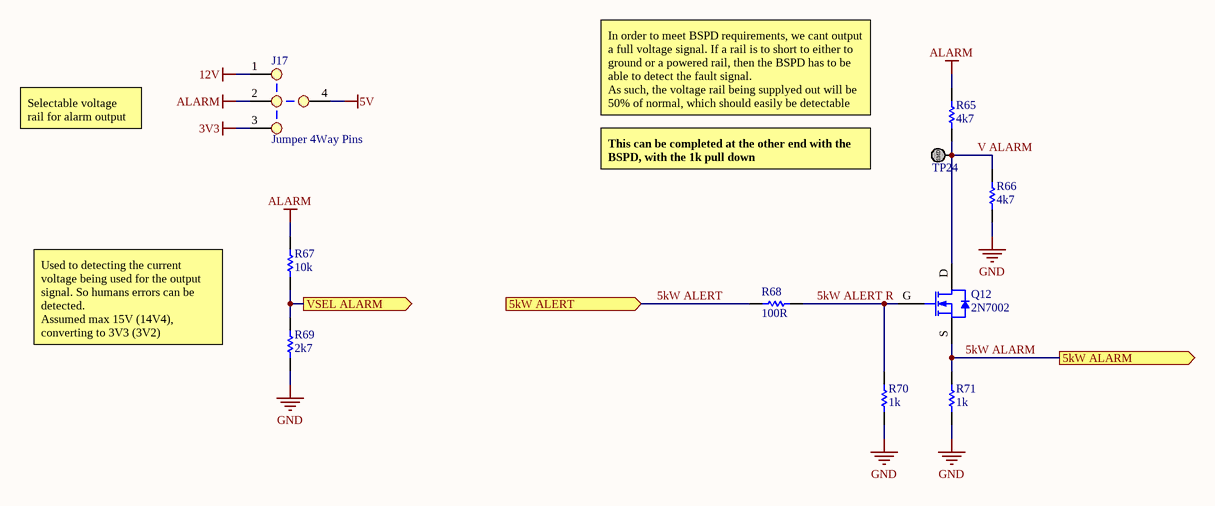
[diagram p20: AMU-S22-V00-CURRENT5kWAlarm.SchDoc]

### Parts
(Parts that share a designator on the sheet are numbered #1, #2 ... from top to bottom, then left to right.)
J17#2  Jumper 4Way Pins  [Jumper_4Way_Pin]
Q12  2N7002  [SOT23-3]
R65  4k7  [Res_ThinFilm_0603]
R66  4k7  [Res_ThinFilm_0603]
R67  10k  [Res_ThinFilm_0603]
R68  100R  [Res_ThinFilm_0603]
R69  2k7  [Res_ThinFilm_0603]
R70  1k  [Res_ThinFilm_0603]
R71  1k  [Res_ThinFilm_0603]
TP24  TestPoint_SMD  [TestPointSMD]  (value not drawn)

### Ports
5kW ALARM (out), 5kW ALERT (in), VSEL ALARM (out)

### Nets
3V3: J17#2.3
5V: J17#2.4
12V: J17#2.1  [project net HV ON]
ALARM: J17#2.2 R65.2 R67.2
GND: R66.1 R69.1 R70.1 R71.1
5kW ALARM: Q12.S R71.2 ; port 5kW ALARM
5kW ALERT: R68.1 ; port 5kW ALERT
5kW ALERT R: Q12.G R68.2 R70.2
V ALARM: Q12.D R65.1 R66.2 TP24.1
NetR67_1: R67.1 R69.2 ; port VSEL ALARM

### Notes on the sheet
- In order to meet BSPD requirements, we cant output a full voltage signal. If a rail is to short to either to ground or a powered rail, then the BSPD has to be able to detect the fault signal.
  As such, the voltage rail being supplyed out will be 50% of normal, which should easily be detectable
- Selectable voltage rail for alarm output
- This can be completed at the other end with the BSPD, with the 1k pull down
- Used to detecting the current voltage being used for the output signal. So humans errors can be detected.
  Assumed max 15V (14V4), converting to 3V3 (3V2)
- Revision History:
- Sheet Title:
- Rev
- Date
- Description
- Project:
- Size:
- Drawn By:
- A3
- Number:
- Revision:
- Sheet
- Version:
- of
- QUT Motorsport
- O-120, Gardens Point
- 2 George Street
- Brisbane, QLD 4000
- Australia
- Print Date:
- Print Time:
- File Name:
- (in symbol TestPoint_SMD) SMD

### Library data of the parts
R65 R66 = 4k7 5% 0603: Resistor, SMD, 4k7, 0.1W, 5%, 0603
R67 = 10k 5% 0603: Resistor, SMD, 10k, 0.1W, 5%, 0603
R68 = 100R 5%, 0603: Resistor, SMD, 100R, 0.1W, 5%, 0603
R69 = 2k7 5% 0603: Resistor, SMD, 2k7, 0.1W, 5%, 0603
R70 R71 = 1k 5% 0603: Resistor, SMD, 1k, 0.1W, 5%, 0603

## Sheet AMU-S02-V00-12VProtection.schdoc
size A3; SheetNumber: 2; SheetTotal: 25
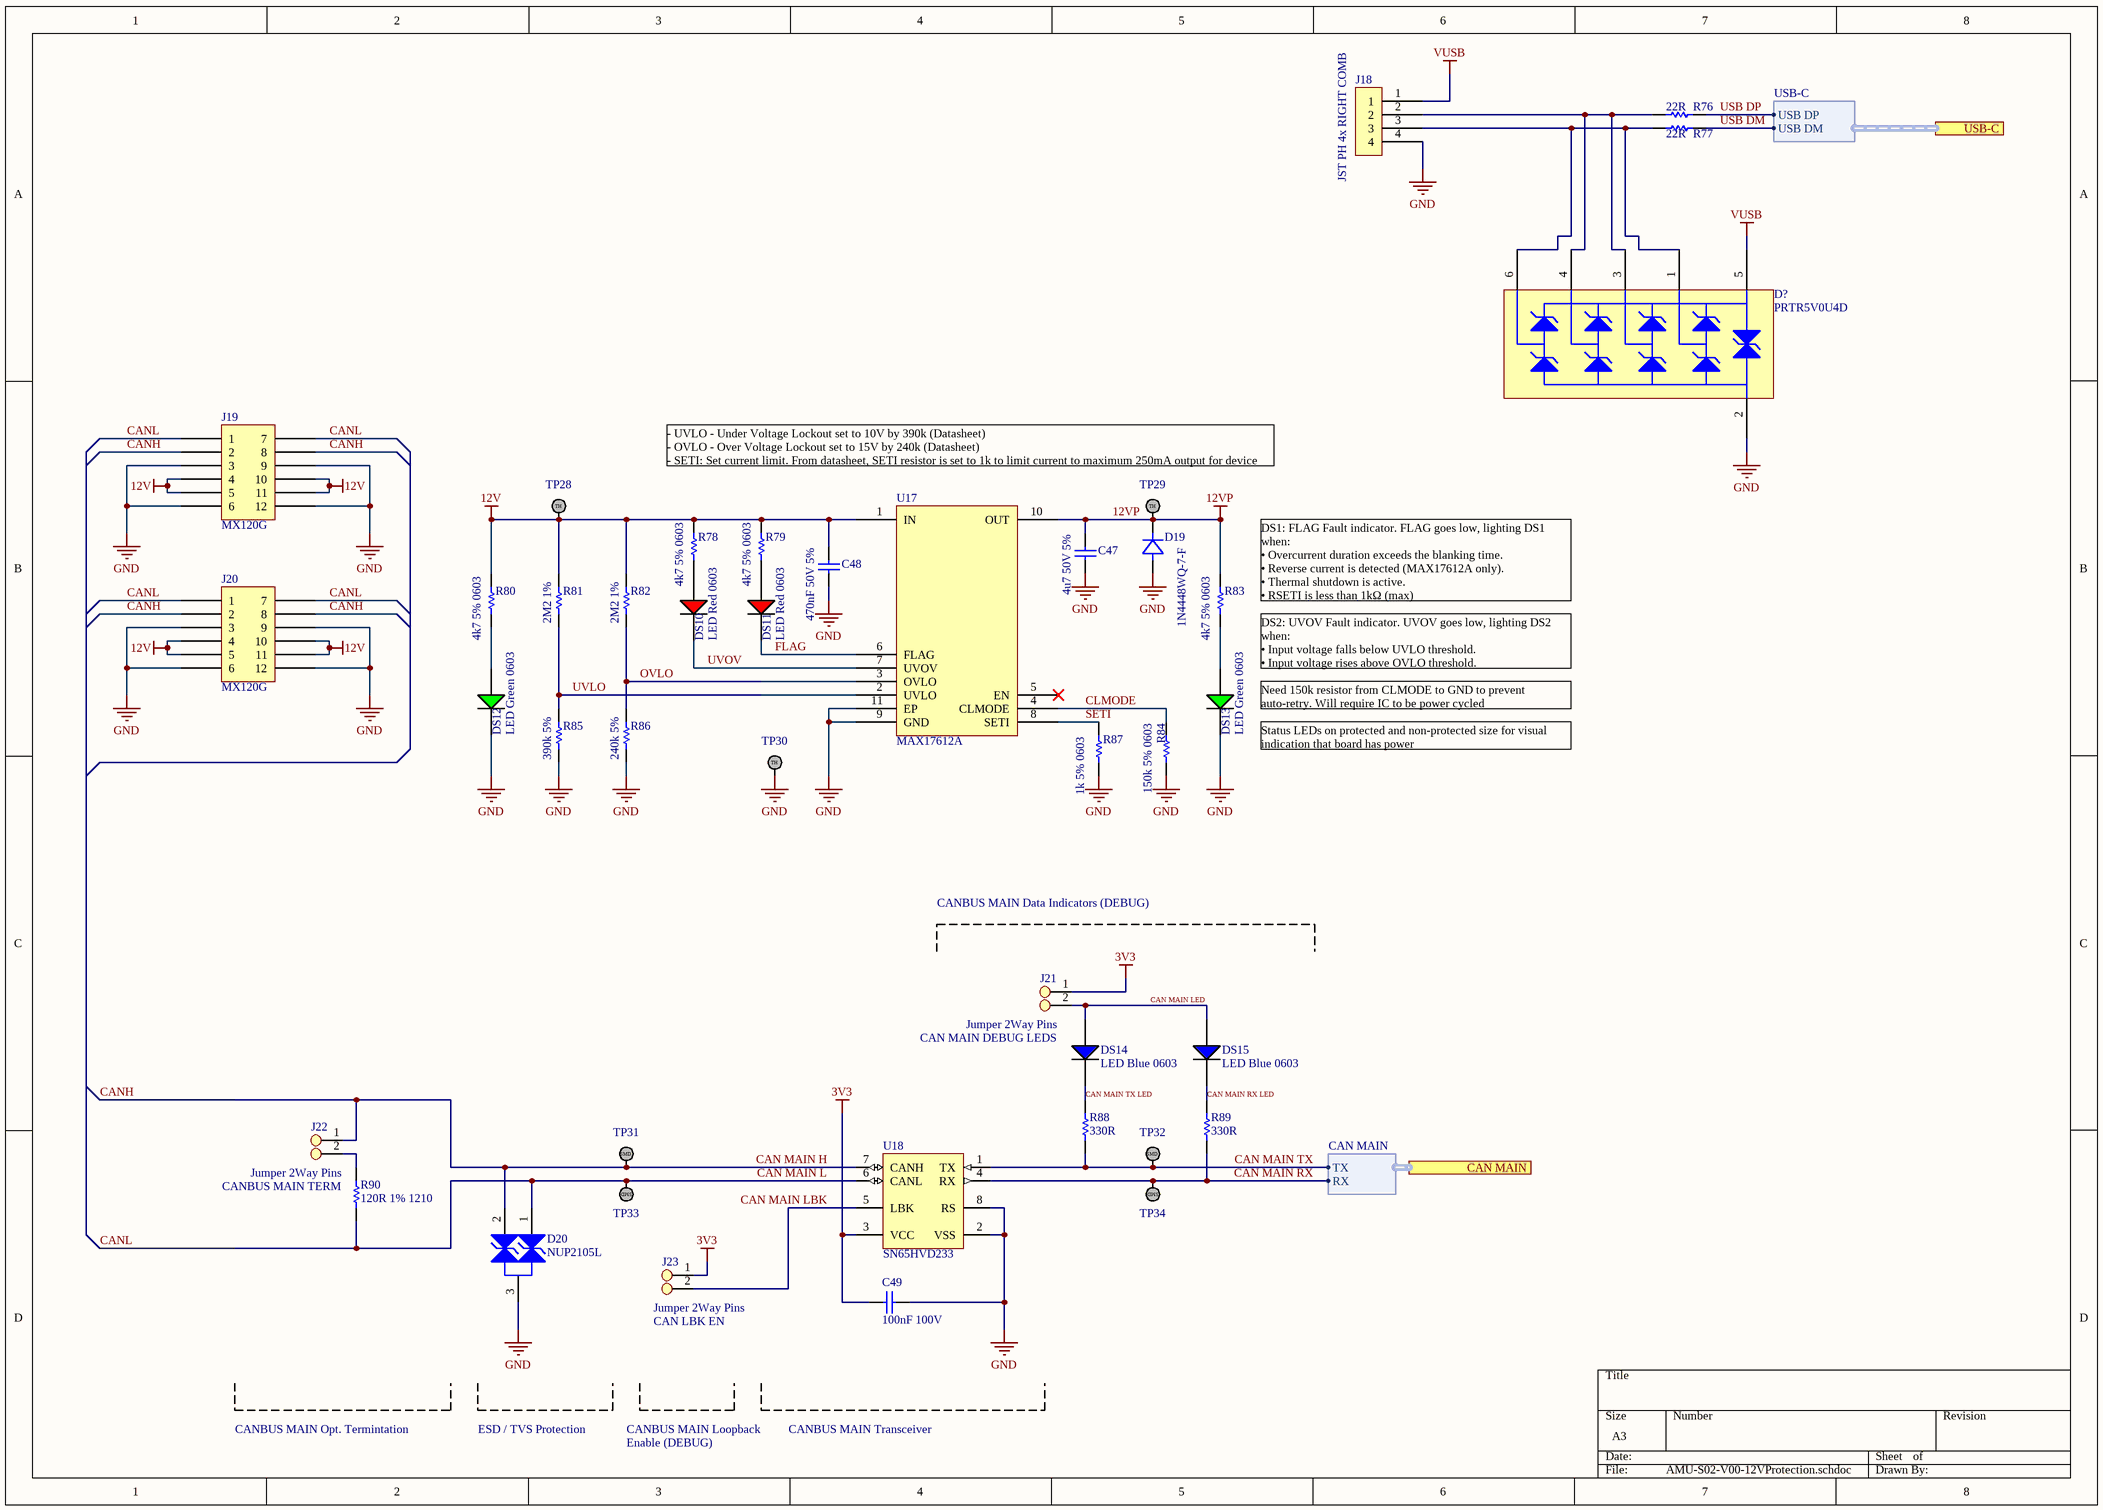
[diagram p21: AMU-S02-V00-12VProtection.schdoc]

### Parts
(Parts that share a designator on the sheet are numbered #1, #2 ... from top to bottom, then left to right.)
C47  4u7 50V 5%  [Cap_Ceramic_0603]
C48  470nF 50V 5%  [Cap_Ceramic_0603]
C49  100nF 100V  [Cap_Ceramic_0603]
D19  1N4448WQ-7-F  [SMA]
D20  NUP2105L  [NUP2105L]
D?  PRTR5V0U4D  [SC-47]
DS10  LED Red 0603  [LED RED 0603]
DS11  LED Red 0603  [LED RED 0603]
DS12  LED Green 0603  [LED GREEN 0603]
DS13  LED Green 0603  [LED GREEN 0603]
DS14  LED Blue 0603  [LED BLUE 0603]
DS15  LED Blue 0603  [LED BLUE 0603]
J18  JST PH 4x RIGHT COMB  [JST PH 4x RIGHT COMB]
J19#2  MX120G  [MX120G]
J20#2  MX120G  [MX120G]
J21#2  Jumper 2Way Pins  [Jumper_2Way_Pin]
J22#2  Jumper 2Way Pins  [Jumper_2Way_Pin]
J23  Jumper 2Way Pins  [Jumper_2Way_Pin]
R76  22R  [Res_ThinFilm_1210]
R77  22R  [Res_ThinFilm_1210]
R78  4k7 5% 0603  [Res_ThinFilm_0603]
R79  4k7 5% 0603  [Res_ThinFilm_0603]
R80  4k7 5% 0603  [Res_ThinFilm_0603]
R81  2M2 1%  [Res_ThinFilm_0603]
R82  2M2 1%  [Res_ThinFilm_0603]
R83  4k7 5% 0603  [Res_ThinFilm_0603]
R84  150k 5% 0603  [Res_ThinFilm_0603]
R85  390k 5%  [Res_ThinFilm_0603]
R86  240k 5%  [Res_ThinFilm_0603]
R87  1k 5% 0603  [Res_ThinFilm_0603]
R88  330R  [Res_ThinFilm_0603]
R89  330R  [Res_ThinFilm_0603]
R90  120R 1% 1210  [Res_ThinFilm_1210]
TP28  TestPoint  [TestPoint]  (value not drawn)
TP29  TestPoint  [TestPoint]  (value not drawn)
TP30  TestPoint  [TestPoint]  (value not drawn)
TP31  TestPoint_SMD  [TestPointSMD]  (value not drawn)
TP32  TestPoint_SMD  [TestPointSMD]  (value not drawn)
TP33  TestPoint_SMD  [TestPointSMD]  (value not drawn)
TP34  TestPoint_SMD  [TestPointSMD]  (value not drawn)
U17  MAX17612A  [10-Pin TDFN EP]
U18  SN65HVD233  [SN65HVD233DR]

### Ports
CAN MAIN (harness CAN MAIN), USB-C (harness USB-C)

### Harnesses
USB-C: USB DP, USB DM
CAN MAIN: RX, TX

### Nets
3V3: C49.2 J21#2.1 J23.1 U18.3(VCC)
12V: C48.2 J19#2.4 J19#2.5 J19#2.10 J19#2.11 J20#2.4 J20#2.5 J20#2.10 J20#2.11 R78.2 R79.2 R80.2 R81.2 R82.2 TP28.1 U17.1(IN)  [project net HV ON]
12VP: C47.2 D19.K(Cathode) R83.2 TP29.1 U17.10(OUT)
GND: C47.1 C48.1 C49.1 D19.A(Anode) D20.3 D?.2(GND) DS12.2(C) DS13.2(C) J18.4 J19#2.3 J19#2.6 J19#2.9 J19#2.12 J20#2.3 J20#2.6 J20#2.9 J20#2.12 R84.1 R85.1 R86.1 R87.1 TP30.1 U17.9(GND) U17.11(EP) U18.2(VSS) U18.8(RS)
VUSB: D?.5(VCC) J18.1
CAN MAIN H: D20.2 J19#2.2 J19#2.8 J20#2.2 J20#2.8 J22#2.1 TP31.1 U18.7(CANH)  [also labelled CANH]
CAN MAIN L: D20.1 J19#2.1 J19#2.7 J20#2.1 J20#2.7 R90.1 TP33.1 U18.6(CANL)  [also labelled CANL]
CAN MAIN LBK: J23.2 U18.5(LBK)
CAN MAIN LED: DS14.1(A) DS15.1(A) J21#2.2
CAN MAIN RX: R89.1 TP34.1 U18.4(RX) ; port CAN MAIN.RX
CAN MAIN RX LED: DS15.2(C) R89.2
CAN MAIN TX: R88.1 TP32.1 U18.1(TX) ; port CAN MAIN.TX
CAN MAIN TX LED: DS14.2(C) R88.2
CLMODE: R84.2 U17.4(CLMODE)
FLAG: DS11.2(C) U17.6(FLAG)
OVLO: R82.1 R86.2 U17.3(OVLO)
SETI: R87.2 U17.8(SETI)
USB DM: R77.2 ; port USB-C.USB DM
USB DP: R76.2 ; port USB-C.USB DP
UVLO: R81.1 R85.2 U17.2(UVLO)
UVOV: DS10.2(C) U17.7(UVOV)
NetD?_1: D?.1(P1) D?.6(P4) J18.3 R77.1
NetD?_3: D?.3(P2) D?.4(P3) J18.2 R76.1
NetDS10_1: DS10.1(A) R78.1
NetDS11_1: DS11.1(A) R79.1
NetDS12_1: DS12.1(A) R80.1
NetDS13_1: DS13.1(A) R83.1
NetJ22#2_2: J22#2.2 R90.2

Not connected (* = marked no-connect by the designer): U17 5(EN)*

### Notes on the sheet
- - UVLO - Under Voltage Lockout set to 10V by 390k (Datasheet)
  - OVLO - Over Voltage Lockout set to 15V by 240k (Datasheet)
  - SETI: Set current limit. From datasheet, SETI resistor is set to 1k to limit current to maximum 250mA output for device
- (near R83) DS1: FLAG Fault indicator. FLAG goes low, lighting DS1 when:
  • Overcurrent duration exceeds the blanking time.
  • Reverse current is detected (MAX17612A only).
  • Thermal shutdown is active.
  • RSETI is less than 1kΩ (max)
- DS2: UVOV Fault indicator. UVOV goes low, lighting DS2 when:
  • Input voltage falls below UVLO threshold.
  • Input voltage rises above OVLO threshold.
- (near DS13) Need 150k resistor from CLMODE to GND to prevent auto-retry. Will require IC to be power cycled
- (near DS13) Status LEDs on protected and non-protected size for visual indication that board has power
- CANBUS MAIN Data Indicators (DEBUG)
- CAN MAIN DEBUG LEDS
- (near R90) CANBUS MAIN TERM
- (near J23) CAN LBK EN
- CANBUS MAIN Opt. Termintation
- ESD / TVS Protection
- CANBUS MAIN Loopback
- Enable (DEBUG)
- CANBUS MAIN Transceiver
- (in symbol TestPoint) TH
- (in symbol TestPoint_SMD) SMD

### Library data of the parts
C47 = 4u7 50V 5% X7R 0603: Capacitor, Ceramic, SMD, 4u7, 50V, 5%, X7R, 0603
C48 = 470nF 50V 5% X7R 0603: Capacitor, Ceramic, SMD, 470nF, 50V, 5%, X7R, 0603
C49 = 100nF 100V 5% X7R 0603: Capacitor, Ceramic, SMD, 100nF, 100V, 5%, X7R, 0603
D19 = 1N4448WQ-7-F: Diode, SMD, 75V, 5%, 250mA, SOD123; Manufacturer: ON Semiconductor / Fairchild; Manufacturer Part Number: 1N914BWS; Average Rectified Current: 150mA; Element Configuration: Single; Forward Voltage: 1V; Max Reverse Leakage Current: 5uA; Power Dissipation: 200mW; Recovery Time: 4ns; Max Forward Surge Current (Ifsm): 4A; Parameter 1: *; Weight: 0.0276g; Category: Rectifier Diodes; Contact Plating: Tin,Matte; Forward Current: 150mA; Lead Free: Lead Free; Max Operating Temperature: 150°C; Max Repetitive Reverse Voltage (Vrrm): 75V; Max Reverse Voltage (DC): 75V; Min Operating Temperature: -55°C; Mount: Surface Mount; Number of Pins: 2; Package Quantity: 1; Packaging: Tape and Reel; Peak Reverse Current: 5uA; Radiation Hardening: No; REACH SVHC: No SVHC; Reverse Recovery Time: 4ns; Height: 1mm; Length: 1.8mm; Reverse Voltage: 75V; Width: 1.35mm
D? = PRTR5V0U4D: Clamp Ipp Tvs Diode Surface Mount 6-TSOP
J19#2 J20#2 = MX120G: MX120G with standard connector layout
J21#2 J22#2 J23 = Jumper 2Way Side Pins
R76 R77 R90 = 120R 1% 1210: Resistor, SMD, 120R, 0.25W, 1%, 1210
R78-R80 R83 = 4k7 5% 0603: Resistor, SMD, 4k7, 0.1W, 5%, 0603
R81 R82 = 2M2 1% 0603: Resistor, SMD, 2M2, 0.125W, 1%, 0603
R84 = 150k 5%, 0603: Resistor, SMD, 150k, 0.1W, 5%, 0603
R85 = 390k 5% 0603: Resistor, SMD, 390k, 0.1W, 5%, 0603
R86 = 240k 5% 0603: Resistor, SMD, 240k, 0.1W, 5%, 0603
R87 = 1k 5% 0603: Resistor, SMD, 1k, 0.1W, 5%, 0603
R88 R89 = 330R 5% 0603: Resistor, SMD, 330R, 0.1W, 5%, 0603
U17 = MAX17612A: 4.5V to 60V, 250mA Current-Limiter with OV, UV, and Reverse Protection; ComponentLink1Description: Datasheet; ComponentLink1URL: https://datasheets.maximintegrated.com/en/ds/MAX17612A-MAX17612C.pdf
D20 = NUP2105L: ComponentLink1Description: Datasheet; ComponentLink1URL: https://www.onsemi.cn/PowerSolutions/document/NUP2105L-D.PDF; Parameter 1: *; ComponentLink2Description: LCSC; ComponentLink2URL: https://lcsc.com/product-detail/TVS_ON-Semiconductor-NUP2105LT1G_C14486.html; ComponentLink3Description: Digikey; ComponentLink3URL: https://www.digikey.com.au/product-detail/en/on-semiconductor/SZNUP2105LT1G/SZNUP2105LT1GOSCT-ND/3487669
U18 = SN65HVD233: ComponentLink1Description: LCSC; ComponentLink1URL: https://lcsc.com/product-detail/CAN-ICs_Texas-Instruments_SN65HVD233DRG4_Texas-Instruments-Texas-Instruments-SN65HVD233DRG4_C61643.html; ComponentLink2Description: Digikey; ComponentLink2URL: https://www.digikey.com.au/product-detail/en/texas-instruments/SN65HVD233DR/296-35967-1-ND/4134960; ComponentLink3Description: Datasheet; ComponentLink3URL: https://www.ti.com/lit/ds/symlink/sn65hvd233.pdf?ts=1588560888178; ComponentLink4Description: Ti Product Page; ComponentLink4URL: https://www.ti.com/product/SN65HVD233

## Sheet AMU-S08-V00-AMSIDCloops.SchDoc: BMS Interface
size A3; DrawnBy: Thomas Benedetti; DocumentNumber: 8; SheetNumber: 8; SheetTotal: 25; Version: 00; Project: AMU 2020; PageSetup: Record=PageOptions|CenterHorizontal=True|CenterVertical=True|PrintScale=0.97|XCorrection=1.00|YCorrection=1.00|PrintKind=0|BorderSize=5000000|LeftOffset=0|BottomOffset=0|Orientation=2|PaperLength=1000|PaperWidth=1000|Scale=100|PaperSource=7|PrintQuality=-4|MediaType=1|DitherType=10|PaperKind=A4|PrintScaleMode=1
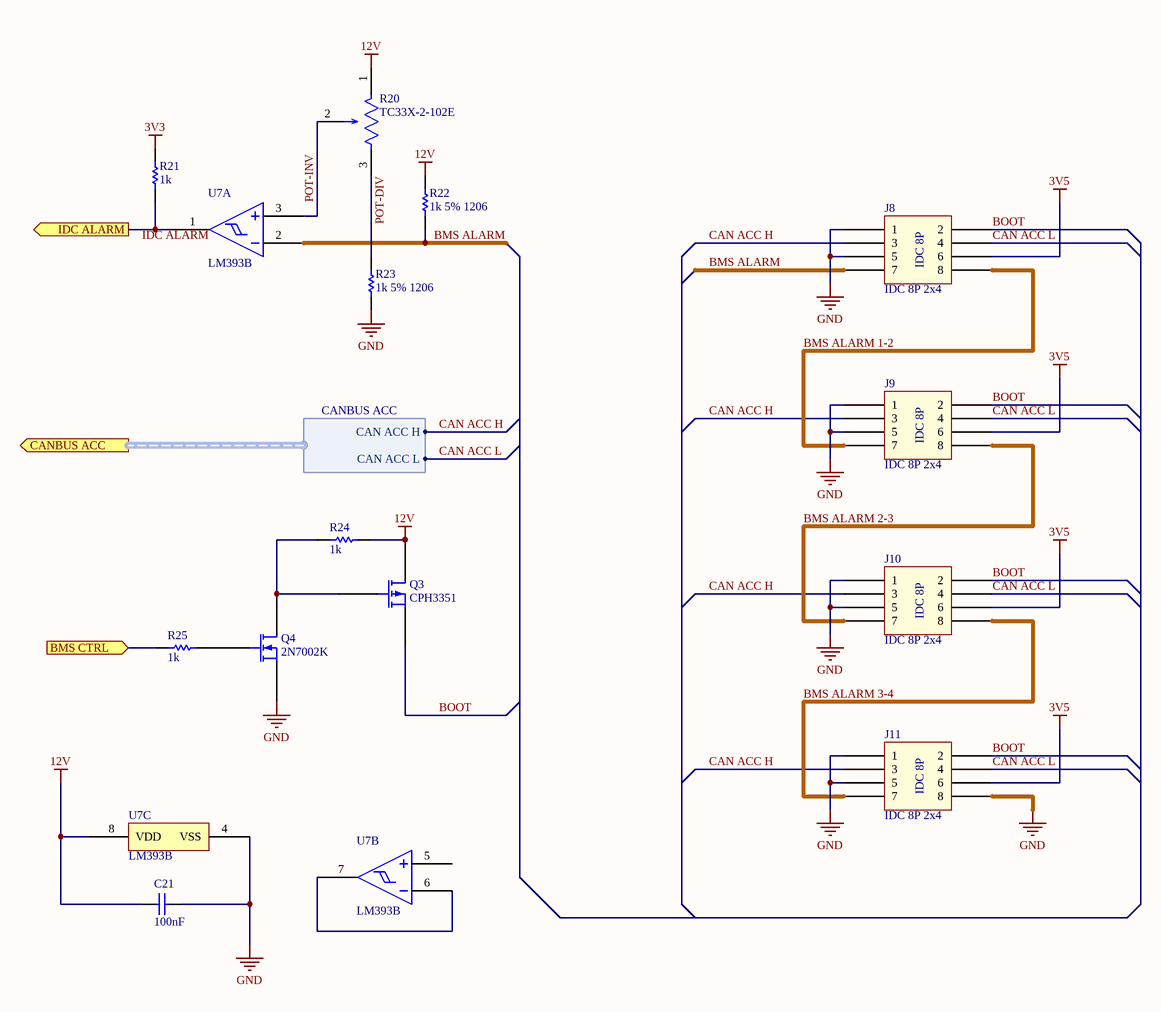
[diagram p22: AMU-S08-V00-AMSIDCloops.SchDoc]

### Parts
C21  100nF  [Cap_Ceramic_0603]
J8  IDC 8P 2x4  [IDC 2.54MM 8P]
J9  IDC 8P 2x4  [IDC 2.54MM 8P]
J10  IDC 8P 2x4  [IDC 2.54MM 8P]
J11  IDC 8P 2x4  [IDC 2.54MM 8P]
Q3  CPH3351  [SOT-23-3]
Q4  2N7002K  [SOT-23-3]
R20  TC33X-2-102E  [TC33]
R21  1k  [Res_ThinFilm_0603]
R22  1k 5% 1206  [Res_ThinFilm_1206]
R23  1k 5% 1206  [Res_ThinFilm_1206]
R24  1k  [Res_ThinFilm_0603]
R25  1k  [Res_ThinFilm_1206]
U7  LM393B  [SOIC-8]  (parts A,B,C of 3)

### Ports
BMS CTRL (in), CANBUS ACC (out, harness CANBUS ACC), IDC ALARM (out)

### Harnesses
CANBUS ACC: CAN ACC H, CAN ACC L

### Nets
3V3: R21.2
3V5: J8.6 J9.6 J10.6 J11.6
12V: C21.1 Q3.D R20.1 R22.2 R24.2 U7.8(VDD)  [project net HV ON]
GND: C21.2 J8.1 J8.5 J9.1 J9.5 J10.1 J10.5 J11.1 J11.5 J11.8 Q4.S R23.1 U7.4(VSS)
BMS ALARM: J8.7 R22.1 U7.2(IN1-)
BMS ALARM 1-2: J8.8 J9.7
BMS ALARM 2-3: J9.8 J10.7
BMS ALARM 3-4: J10.8 J11.7
BMS CTRL: R25.1 ; port BMS CTRL
BOOT: J8.2 J9.2 J10.2 J11.2 Q3.S
CAN ACC H: J8.3 J9.3 J10.3 J11.3 ; port CANBUS ACC.CAN ACC H
CAN ACC L: J8.4 J9.4 J10.4 J11.4 ; port CANBUS ACC.CAN ACC L
IDC ALARM: R21.1 U7.1(OUT1) ; port IDC ALARM
POT-DIV: R20.3 R23.2
POT-INV: R20.2 U7.3(IN1+)
NetQ3_G: Q3.G Q4.D R24.1
NetQ4_G: Q4.G R25.2
NetU7_6: U7.6(IN2-) U7.7(OUT1)

Not connected (* = marked no-connect by the designer): U7 5(IN2+)

### Notes on the sheet
- Labels drawn without touching a wire or pin: IDC ALARM
- Revision History:
- Sheet Title:
- Rev
- Date
- Description
- Project:
- Size:
- Drawn By:
- A3
- Number:
- Revision:
- Sheet
- Version:
- of
- QUT Motorsport
- O-120, Gardens Point
- 2 George Street
- Brisbane, QLD 4000
- Australia
- Print Date:
- Print Time:
- File Name:
- (in symbol IDC 8P 2x4) IDC 8P

### Library data of the parts
C21 = 100nF 50V 5% X7R 0603: as C41 on sheet AMU-S20-V00-CURRENTLEMInterface
Q3 = CPH3351: P-Channel 60V 1.8A (Ta) 1W (Ta) Surface Mount 3-CPH; ComponentLink1Description: Datasheet; ComponentLink1URL: https://www.onsemi.com/pub/Collateral/CPH3351-D.PDF; ComponentLink2Description: Digikey; ComponentLink2URL: https://www.digikey.com/products/en/discrete-semiconductor-products/transistors-fets-mosfets-single/278?k=&pkeyword=&sv=0&pv7=2&sf=0&FV=-1%7C488%2C-8%7C278&mpart=CPH3351-TL-W&quantity=&ColumnSort=0&page=1&stock=1&nstock=1&datasheet=1&photo=1&pageSize=25
Q4 = 2N7002K: N-Channel 60V 300mA (Ta) 350mW (Ta) Surface Mount SOT-23 (TO-236AB)
R20 = TC33X-2-102E: 1 kOhms 0.1W, 1/10W J Lead Surface Mount Trimmer Potentiometer Cermet 1 Turn Top Adjustment
R21 R24 = 1k 5% 0603: Resistor, SMD, 1k, 0.1W, 5%, 0603
R22 R23 R25 = 1k 5% 1206: 1 kOhms ±5% 0.25W, 1/4W Chip Resistor 1206 (3216 Metric) Moisture Resistant Thick Film; ComponentLink1Description: Datasheet; ComponentLink1URL: https://www.yageo.com/upload/media/product/productsearch/datasheet/rchip/PYu-RC_Group_51_RoHS_L_10.pdf
U7 = LM393B: Comparator General Purpose Open-Collector 8-SOIC

## Sheet AMU-S05-V00-CANMAIN.SchDoc: Isolated CANBUS2 3V3
size A3; DrawnBy: Jonn Dillon; DocumentNumber: 5; Revision: 01; SheetNumber: 6; SheetTotal: 25; Version: 01; Project: AMU 2020 (Sourced from BMS 2020); PageSetup: Record=PageOptions|CenterHorizontal=True|CenterVertical=True|PrintScale=0.97|XCorrection=1.00|YCorrection=1.00|PrintKind=0|BorderSize=5000000|LeftOffset=0|BottomOffset=0|Orientation=2|PaperLength=1000|PaperWidth=1000|Scale=100|PaperSource=7|PrintQuality=-4|MediaType=1|DitherType=10|PaperKind=A4|PrintScaleMode=1
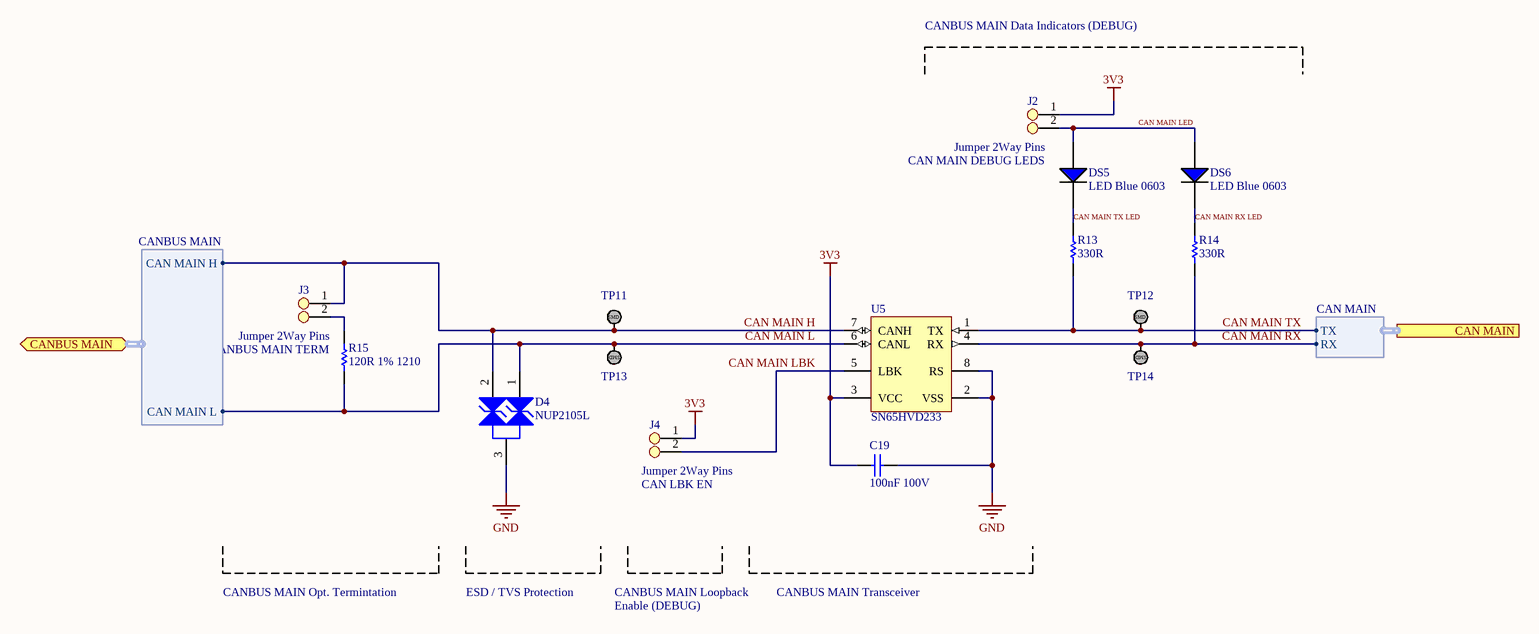
[diagram p23: AMU-S05-V00-CANMAIN.SchDoc]

### Parts
C19  100nF 100V  [Cap_Ceramic_0603]
D4  NUP2105L  [NUP2105L]
DS5  LED Blue 0603  [LED BLUE 0603]
DS6  LED Blue 0603  [LED BLUE 0603]
J2  Jumper 2Way Pins  [Jumper_2Way_Pin]
J3  Jumper 2Way Pins  [Jumper_2Way_Pin]
J4  Jumper 2Way Pins  [Jumper_2Way_Pin]
R13  330R  [Res_ThinFilm_0603]
R14  330R  [Res_ThinFilm_0603]
R15  120R 1% 1210  [Res_ThinFilm_1210]
TP11  TestPoint_SMD  [TestPointSMD]  (value not drawn)
TP12  TestPoint_SMD  [TestPointSMD]  (value not drawn)
TP13  TestPoint_SMD  [TestPointSMD]  (value not drawn)
TP14  TestPoint_SMD  [TestPointSMD]  (value not drawn)
U5  SN65HVD233  [SN65HVD233DR]

### Ports
CAN MAIN (harness CAN MAIN), CANBUS MAIN (bidir, harness CANBUS MAIN)

### Harnesses
CANBUS MAIN: CAN MAIN H, CAN MAIN L
CAN MAIN: RX, TX

### Nets
3V3: C19.2 J2.1 J4.1 U5.3(VCC)
GND: C19.1 D4.3 U5.2(VSS) U5.8(RS)
CAN MAIN H: D4.2 J3.1 TP11.1 U5.7(CANH) ; port CANBUS MAIN.CAN MAIN H
CAN MAIN L: D4.1 R15.1 TP13.1 U5.6(CANL) ; port CANBUS MAIN.CAN MAIN L
CAN MAIN LBK: J4.2 U5.5(LBK)
CAN MAIN LED: DS5.1(A) DS6.1(A) J2.2
CAN MAIN RX: R14.1 TP14.1 U5.4(RX) ; port CAN MAIN.RX
CAN MAIN RX LED: DS6.2(C) R14.2
CAN MAIN TX: R13.1 TP12.1 U5.1(TX) ; port CAN MAIN.TX
CAN MAIN TX LED: DS5.2(C) R13.2
NetJ3_2: J3.2 R15.2

### Notes on the sheet
- CANBUS MAIN Data Indicators (DEBUG)
- CAN MAIN DEBUG LEDS
- (near R15) CANBUS MAIN TERM
- (near J4) CAN LBK EN
- CANBUS MAIN Opt. Termintation
- ESD / TVS Protection
- CANBUS MAIN Loopback
- Enable (DEBUG)
- CANBUS MAIN Transceiver
- Revision History:
- Sheet Title:
- Rev
- Date
- Description
- Project:
- Size:
- Drawn By:
- A3
- Number:
- Revision:
- Sheet
- Version:
- of
- QUT Motorsport
- O-120, Gardens Point
- 2 George Street
- Brisbane, QLD 4000
- Australia
- Print Date:
- Print Time:
- File Name:
- (in symbol TestPoint_SMD) SMD

### Library data of the parts
C19 = 100nF 100V 5% X7R 0603: as C49 on sheet AMU-S02-V00-12VProtection
J2-J4 = Jumper 2Way Side Pins
R13 R14 = 330R 5% 0603: Resistor, SMD, 330R, 0.1W, 5%, 0603
R15 = 120R 1% 1210: Resistor, SMD, 120R, 0.25W, 1%, 1210
D4 = NUP2105L: ComponentLink1Description: Datasheet; ComponentLink1URL: https://www.onsemi.cn/PowerSolutions/document/NUP2105L-D.PDF; Parameter 1: *; ComponentLink2Description: LCSC; ComponentLink2URL: https://lcsc.com/product-detail/TVS_ON-Semiconductor-NUP2105LT1G_C14486.html; ComponentLink3Description: Digikey; ComponentLink3URL: https://www.digikey.com.au/product-detail/en/on-semiconductor/SZNUP2105LT1G/SZNUP2105LT1GOSCT-ND/3487669
U5 = SN65HVD233: ComponentLink1Description: LCSC; ComponentLink1URL: https://lcsc.com/product-detail/CAN-ICs_Texas-Instruments_SN65HVD233DRG4_Texas-Instruments-Texas-Instruments-SN65HVD233DRG4_C61643.html; ComponentLink2Description: Digikey; ComponentLink2URL: https://www.digikey.com.au/product-detail/en/texas-instruments/SN65HVD233DR/296-35967-1-ND/4134960; ComponentLink3Description: Datasheet; ComponentLink3URL: https://www.ti.com/lit/ds/symlink/sn65hvd233.pdf?ts=1588560888178; ComponentLink4Description: Ti Product Page; ComponentLink4URL: https://www.ti.com/product/SN65HVD233

## Sheet AMU-S28-V00-USBCProtection.SchDoc
size A4; SheetNumber: 25; SheetTotal: 25
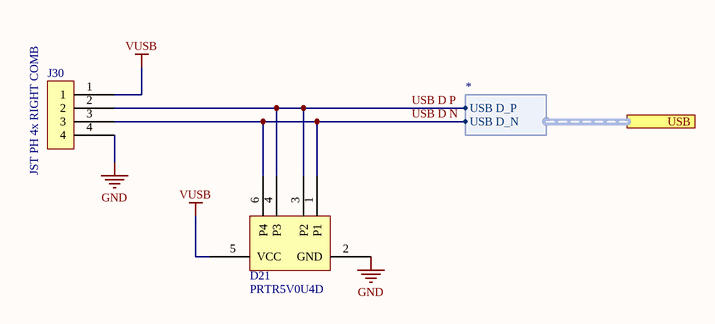
[diagram p24: AMU-S28-V00-USBCProtection.SchDoc]

### Parts
D21  PRTR5V0U4D  [SC-47]
J30  JST PH 4x RIGHT COMB  [JST PH 4x RIGHT COMB]

### Ports
USB (harness *)

### Harnesses
*: USB D_P, USB D_N

### Nets
GND: D21.2(GND) J30.4
VUSB: D21.5(VCC) J30.1
USB D N: D21.1(P1) D21.6(P4) J30.3 ; port USB.USB D_N
USB D P: D21.3(P2) D21.4(P3) J30.2 ; port USB.USB D_P

### Library data of the parts
D21 = PRTR5V0U4D: Clamp Ipp Tvs Diode Surface Mount 6-TSOP